# EAGLE design iit_hawkrod_main_board (EAGLE 9.6.2)
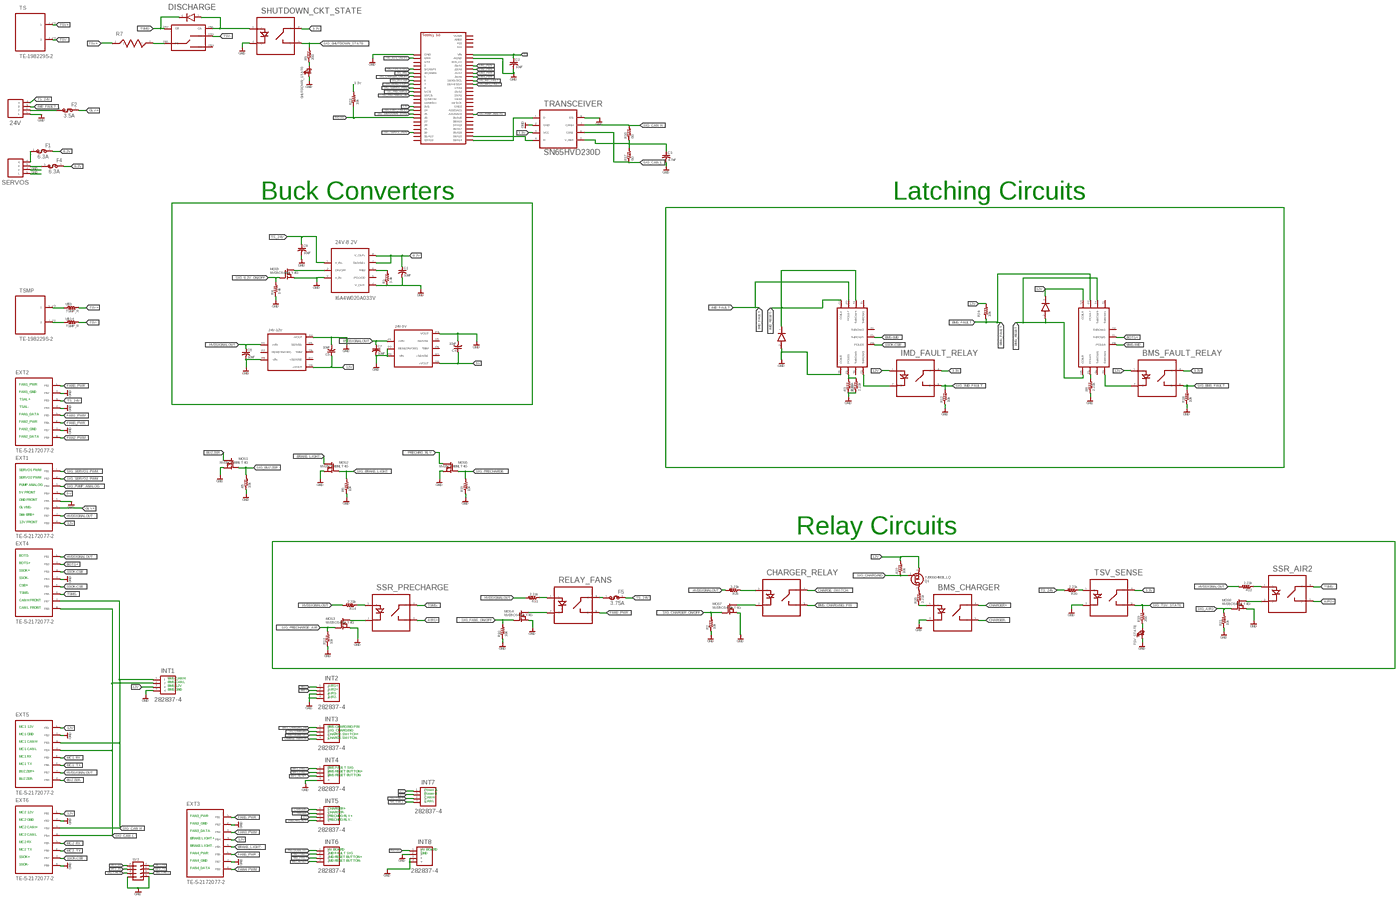
[diagram p0: schematic, sheet 1, overview]
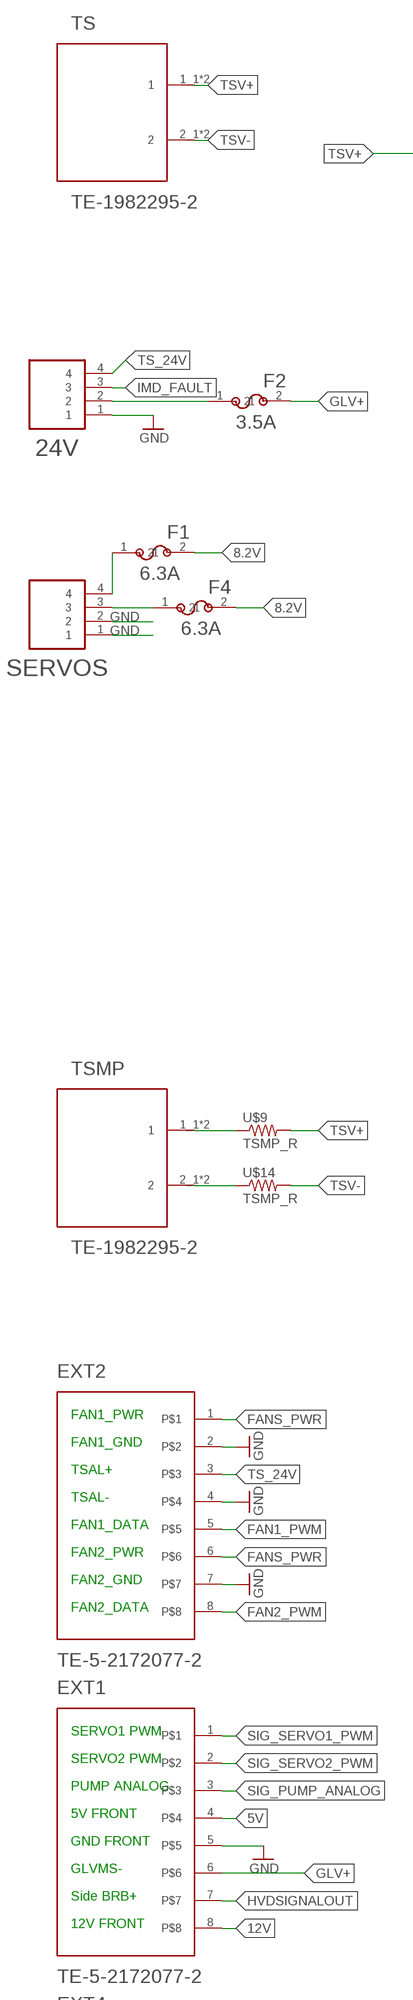
[diagram p1: schematic, sheet 1, part 1 of 5]
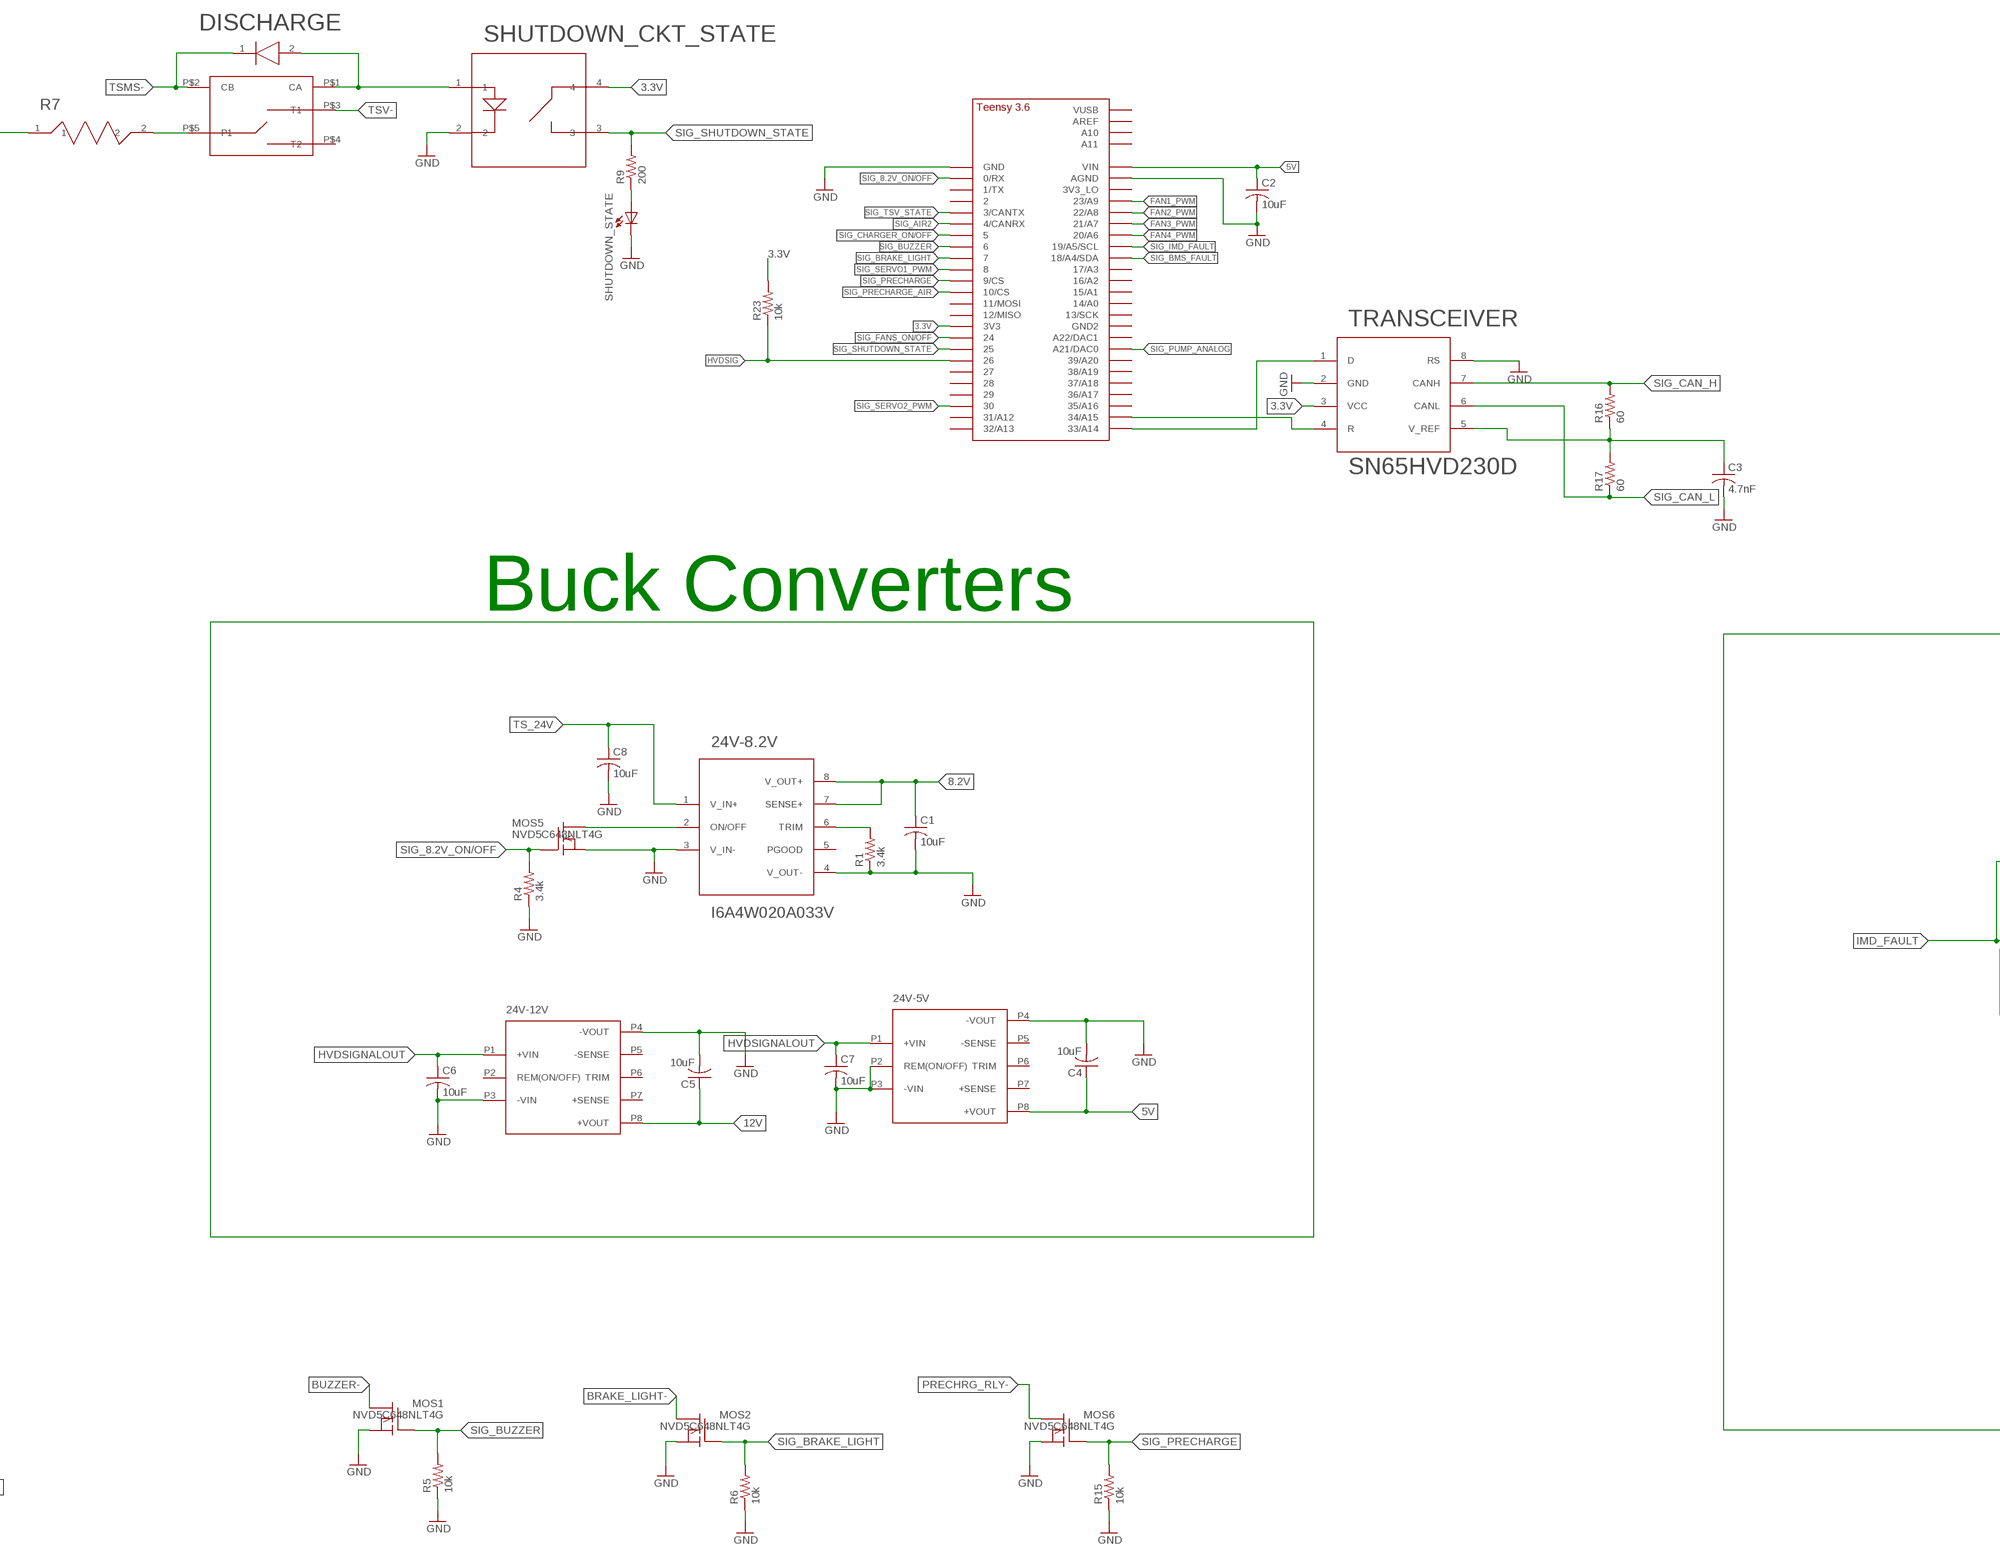
[diagram p2: schematic, sheet 1, part 2 of 5]
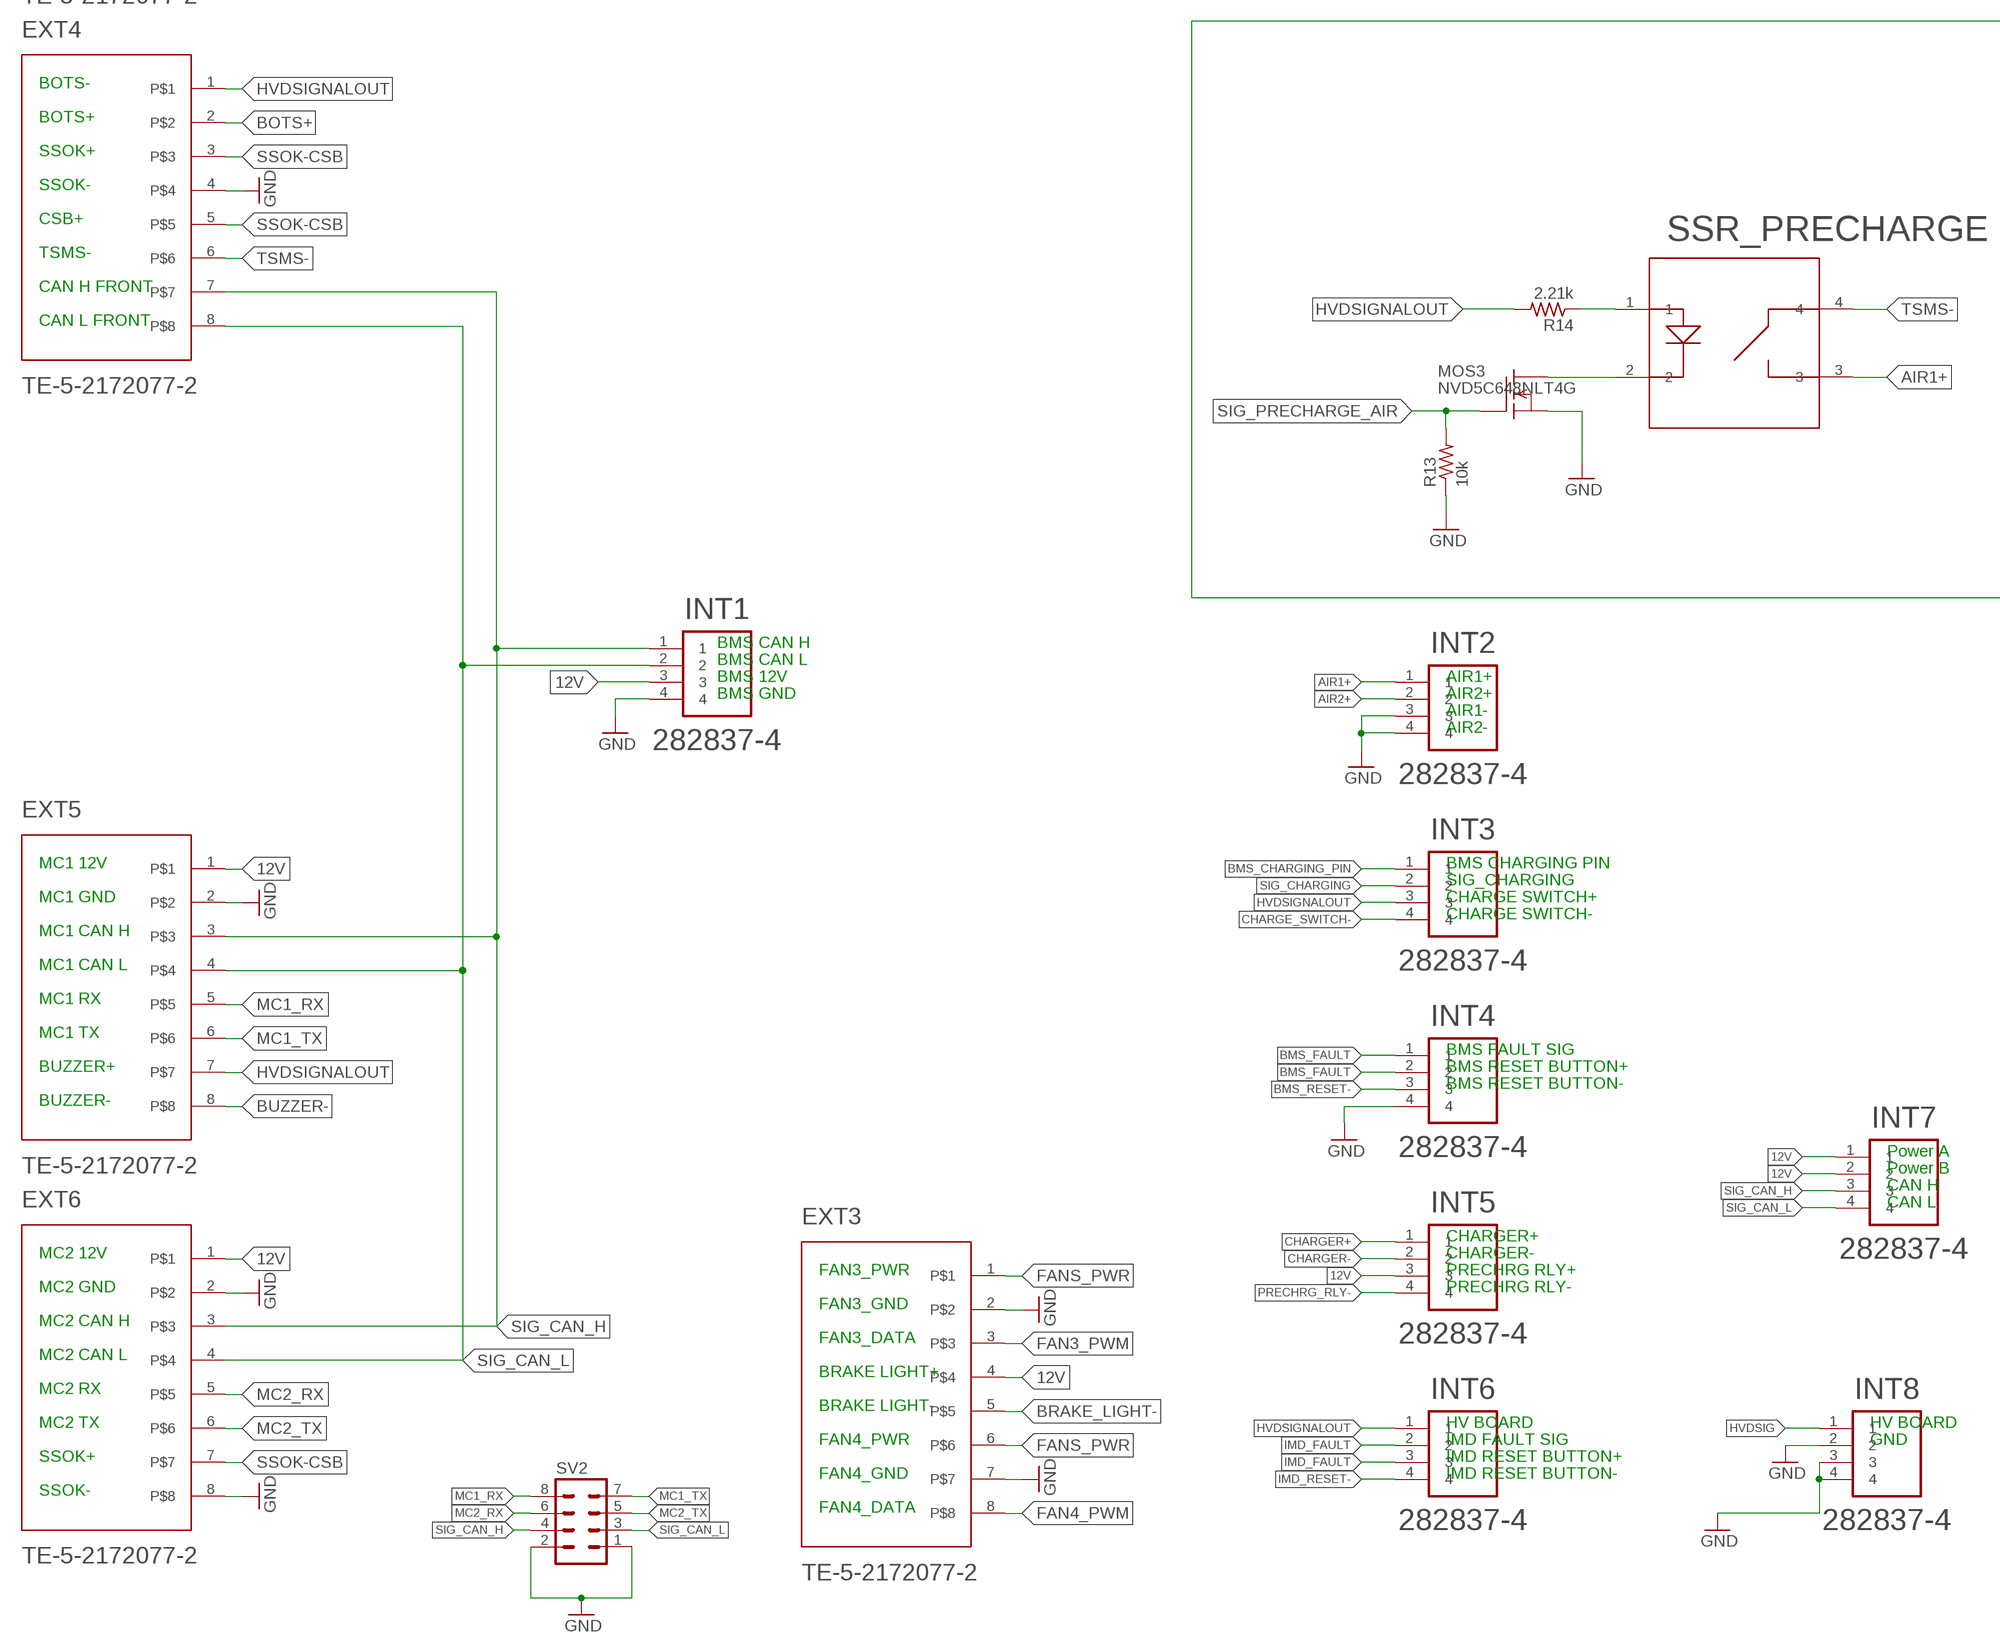
[diagram p3: schematic, sheet 1, part 3 of 5]
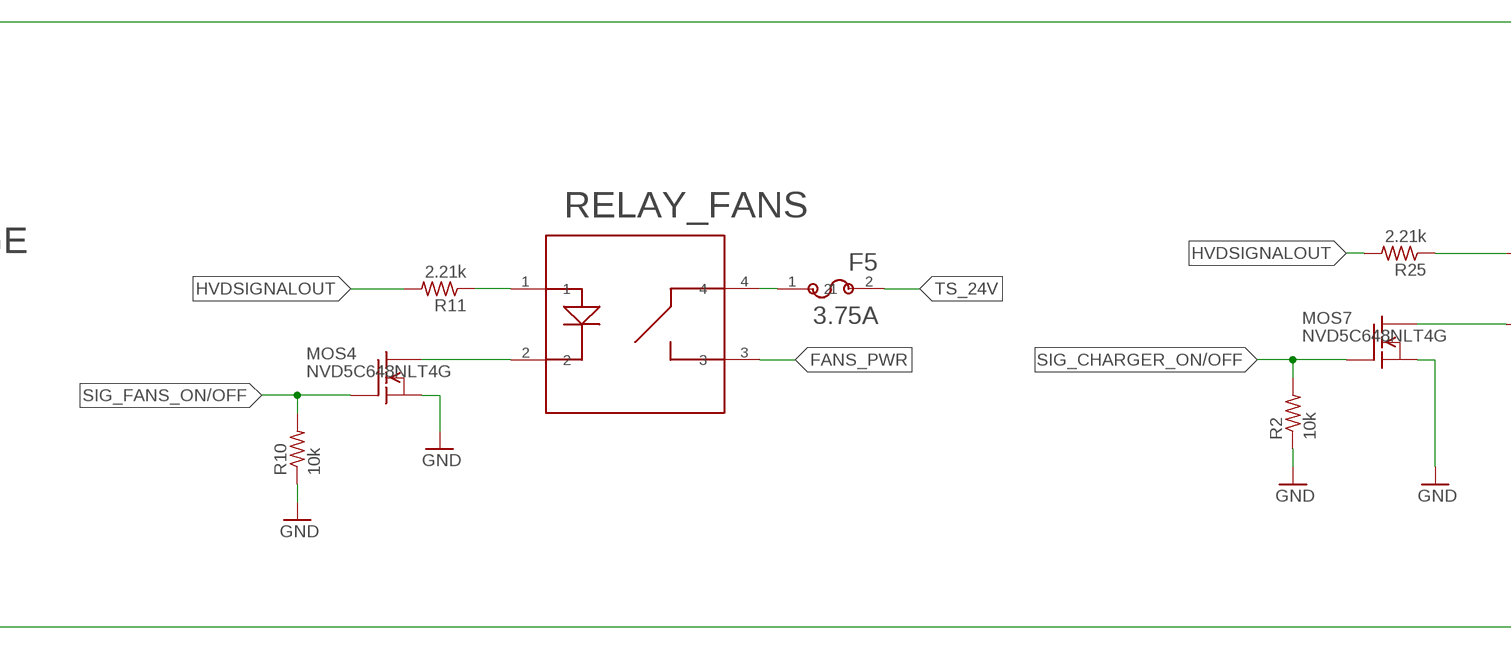
[diagram p4: schematic, sheet 1, part 4 of 5]
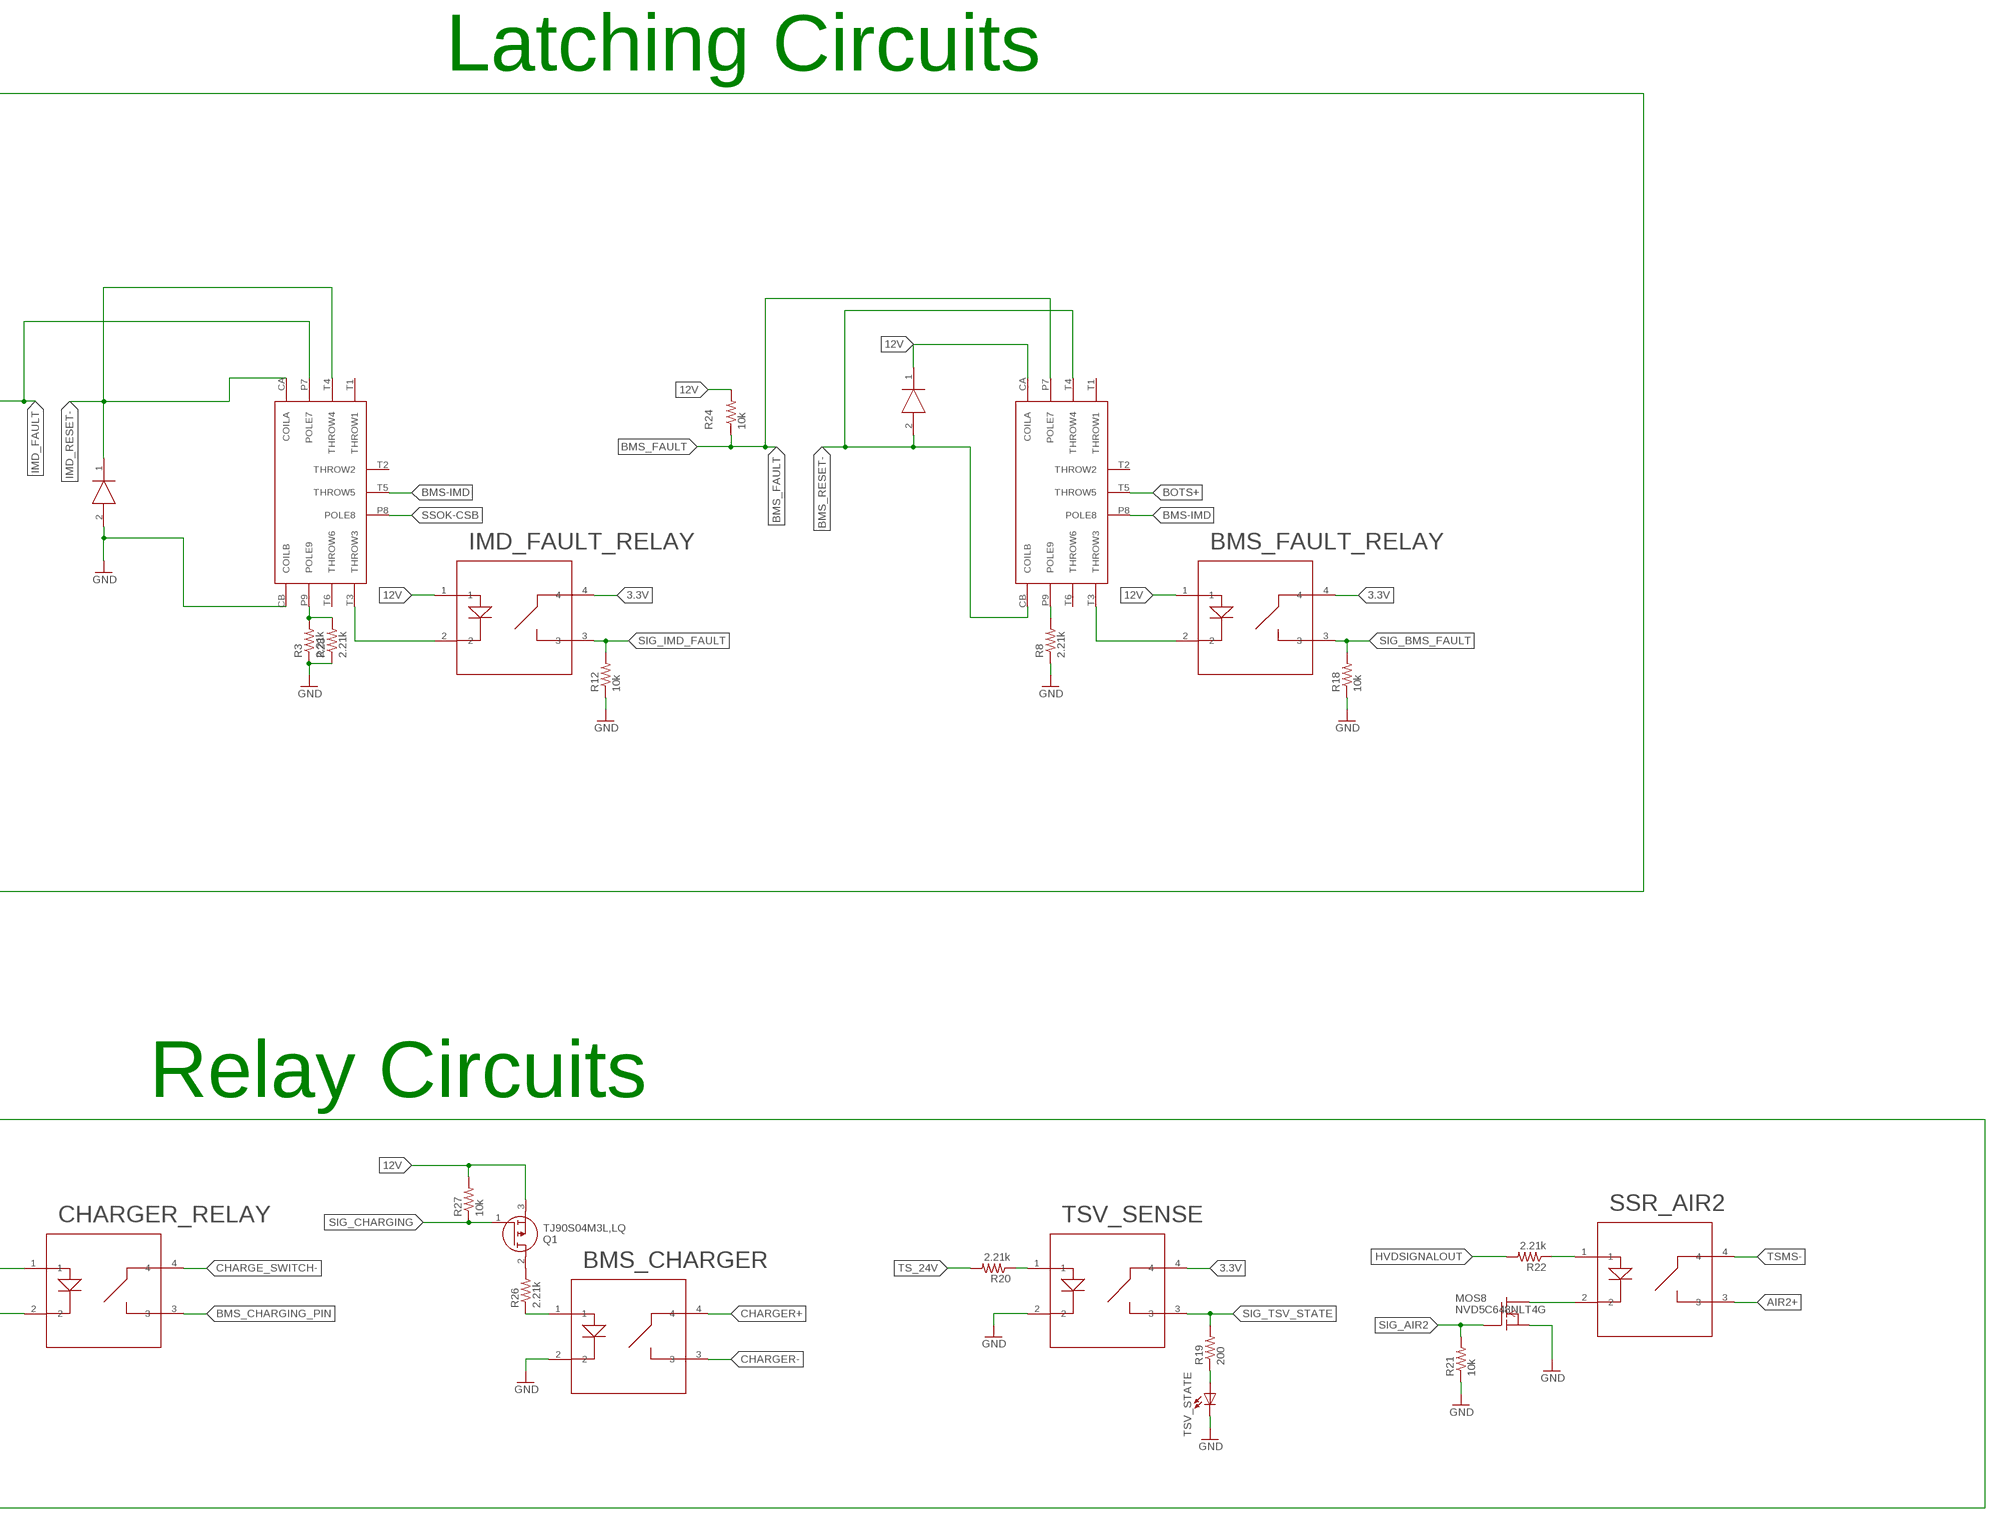
[diagram p5: schematic, sheet 1, part 5 of 5]

## Parts
24V  282837-4  [TE_282837-4]
24V-5V  IRS-5/10-Q12NF-C  [IRS-5/10-Q12NF-C]
24V-8.2V  I6A4W020A033V  [I6A4W020A033V]
24V-12V  IRS-5/10-Q12NF-C  [IRS-5/10-Q12NF-C]
BMS_CHARGER  G3VM-61GR2  [SOP4]
BMS_FAULT_RELAY  G3VM-61GR2  [SOP4]
C1  10uF  C-USC1206  [C1206]
C2  10uF  C-USC1206  [C1206]
C3  4.7nF  C-USC1206  [C1206]
C4  10uF  C-USC1206  [C1206]
C5  10uF  C-USC1206  [C1206]
C6  10uF  C-USC1206  [C1206]
C7  10uF  C-USC1206  [C1206]
C8  10uF  C-USC1206  [C1206]
CHARGER_RELAY  G3VM-61GR2  [SOP4]
EXT1  TE-5-2172077-2  [TE-5-2172077-2]
EXT2  TE-5-2172077-2  [TE-5-2172077-2]
EXT3  TE-5-2172077-2  [TE-5-2172077-2]
EXT4  TE-5-2172077-2  [TE-5-2172077-2]
EXT5  TE-5-2172077-2  [TE-5-2172077-2]
EXT6  TE-5-2172077-2  [TE-5-2172077-2]
F1  6.3A  SMD_FUSE_HOLDER  [SMD_FUSE_HOLDER]
F2  3.5A  SMD_FUSE_HOLDER  [SMD_FUSE_HOLDER]
F4  6.3A  SMD_FUSE_HOLDER  [SMD_FUSE_HOLDER]
F5  3.75A  SMD_FUSE_HOLDER  [SMD_FUSE_HOLDER]
IMD_FAULT_RELAY  G3VM-61GR2  [SOP4]
INT1  282837-4  [TE_282837-4]
INT2  282837-4  [TE_282837-4]
INT3  282837-4  [TE_282837-4]
INT4  282837-4  [TE_282837-4]
INT5  282837-4  [TE_282837-4]
INT6  282837-4  [TE_282837-4]
INT7  282837-4  [TE_282837-4]
INT8  282837-4  [TE_282837-4]
MOS1  NVD5C648NLT4G  [DPAK]
MOS2  NVD5C648NLT4G  [DPAK]
MOS3  NVD5C648NLT4G  [DPAK]
MOS4  NVD5C648NLT4G  [DPAK]
MOS5  NVD5C648NLT4G  [DPAK]
MOS6  NVD5C648NLT4G  [DPAK]
MOS7  NVD5C648NLT4G  [DPAK]
MOS8  NVD5C648NLT4G  [DPAK]
Q1  TJ90S04M3L,LQ  [TJ90S04M3LLQ]
R1  3.4k  R-US_R1206  [R1206]
R2  10k  R-US_R1206  [R1206]
R3  2.21k  R-US_R1206  [R1206]
R4  3.4k  R-US_R1206  [R1206]
R5  10k  R-US_M1206  [M1206]
R6  10k  R-US_M1206  [M1206]
R7  HSA501K0J  [HSA501K0J]
R8  2.21k  R-US_R1206  [R1206]
R9  200  R-US_M1206  [M1206]
R10  10k  R-US_R1206  [R1206]
R11  2.21k  R-US_R1206  [R1206]
R12  10k  R-US_M1206  [M1206]
R13  10k  R-US_M1206  [M1206]
R14  2.21k  R-US_R1206  [R1206]
R15  10k  R-US_M1206  [M1206]
R16  60  R-US_R1206  [R1206]
R17  60  R-US_R1206  [R1206]
R18  10k  R-US_M1206  [M1206]
R19  200  R-US_M1206  [M1206]
R20  2.21k  R-US_R1206  [R1206]
R21  10k  R-US_M1206  [M1206]
R22  2.21k  R-US_R1206  [R1206]
R23  10k  R-US_M1206  [M1206]
R24  10k  R-US_M1206  [M1206]
R25  2.21k  R-US_R1206  [R1206]
R26  2.21k  R-US_R1206  [R1206]
R27  10k  R-US_R1206  [R1206]
R28  2.21k  R-US_R1206  [R1206]
RELAY_FANS  G3VM-61GR2  [SOP4]
SERVOS  282837-4  [TE_282837-4]
SHUTDOWN_CKT_STATE  G3VM-61GR2  [SOP4]
SHUTDOWN_STATE  LEDCHIP-LED0805  [CHIP-LED0805]
SSR_AIR2  G3VM-61GR2  [SOP4]
SSR_PRECHARGE  G3VM-61GR2  [SOP4]
SV2  MA04-2  [MA04-2]
TEENSY_3.6  TEENSY_3.5/3.6_BASIC  [TEENSY_3.5/3.6_BASIC]
TRANSCEIVER  SN65HVD230D  [R-PDSO-8]
TS  TE-1982295-2  [TE-1982295-2]
TSMP  TE-1982295-2  [TE-1982295-2]
TSV_SENSE  G3VM-61GR2  [SOP4]
TSV_STATE  LEDCHIP-LED0805  [CHIP-LED0805]
U$1  G2RL-1-HA  [G2RL-1-HA]
U$3  CS1M-E3/H  [DO-214AC]
U$4  CS1M-E3/H  [DO-214AC]
U$5  CS1M-E3/H  [DO-214AC]
U$6  27E046_RELAY_MOUNT  [27E046_RELAY_MOUNT]
U$7  27E046_RELAY_MOUNT  [27E046_RELAY_MOUNT]
U$9  TSMP_R  [TSMP_R]
U$14  TSMP_R  [TSMP_R]

## Nets
3.3V [20mil]: BMS_FAULT_RELAY.4 IMD_FAULT_RELAY.4 R23.2 SHUTDOWN_CKT_STATE.4 TEENSY_3.6.3V3 TRANSCEIVER.3(VCC) TSV_SENSE.4
5V [20mil]: 24V-5V.P8(+VOUT) C2.1 C4.1 EXT1.4 TEENSY_3.6.VIN
8.2V [Servos]: 24V-8.2V.7(SENSE+) 24V-8.2V.8(V_OUT+) C1.1 F1.2 F4.2
12V [BMS 12V]: 24V-12V.P8(+VOUT) BMS_FAULT_RELAY.1 C5.1 EXT1.8 EXT3.4 EXT5.1 EXT6.1 IMD_FAULT_RELAY.1 INT1.3 INT5.3 INT7.1 INT7.2 Q1.3(S) R24.2 R27.2 U$5.1 U$7.CA(COILA)
AIR1+ [20mil]: INT2.1 SSR_PRECHARGE.3
AIR2+ [20mil]: INT2.2 SSR_AIR2.3
BMS-IMD [20mil]: U$6.T5(THROW5) U$7.P8(POLE8)
BMS_CHARGING_PIN [20mil]: CHARGER_RELAY.3 INT3.1
BMS_FAULT [20mil]: INT4.1 INT4.2 R24.1 U$7.P7(POLE7)
BMS_RESET- [20mil]: INT4.3 U$5.2 U$7.CB(COILB) U$7.T4(THROW4)
BOTS+ [20mil]: EXT4.2 U$7.T5(THROW5)
BRAKE_LIGHT- [20mil]: EXT3.5 MOS2.4(D)
BUZZER- [20mil]: EXT5.8 MOS1.4(D)
CHARGE_SWITCH- [20mil]: CHARGER_RELAY.4 INT3.4
CHARGER+ [20mil]: BMS_CHARGER.4 INT5.1
CHARGER- [20mil]: BMS_CHARGER.3 INT5.2
FAN1_PWM [10mil]: EXT2.5 TEENSY_3.6.23/A9
FAN2_PWM [10mil]: EXT2.8 TEENSY_3.6.22/A8
FAN3_PWM [10mil]: EXT3.3 TEENSY_3.6.21/A7
FAN4_PWM [10mil]: EXT3.8 TEENSY_3.6.20/A6
FANS_PWR [20mil]: EXT2.1 EXT2.6 EXT3.1 EXT3.6 RELAY_FANS.3
GLV+ [2.33A-GLV]: EXT1.6 F2.2
GND [20mil]: 24V-5V.P2(REM(ON/OFF)) 24V-5V.P3(-VIN) 24V-5V.P4(-VOUT) 24V-8.2V.3(V_IN-) 24V-8.2V.4(V_OUT-) 24V-12V.P3(-VIN) 24V-12V.P4(-VOUT) 24V.1 BMS_CHARGER.2 C1.2 C2.2 C3.2 C4.2 C5.2 C6.2 C7.2 C8.2 EXT1.5 EXT2.2 EXT2.4 EXT2.7 EXT3.2 EXT3.7 EXT4.4 EXT5.2 EXT6.2 EXT6.8 INT1.4 INT2.3 INT2.4 INT4.4 INT8.2 INT8.3 INT8.4 MOS1.3(S) MOS2.3(S) MOS3.3(S) MOS4.3(S) MOS5.3(S) MOS6.3(S) MOS7.3(S) MOS8.3(S) R1.1 R2.1 R3.1 R4.1 R5.1 R6.1 R8.1 R10.1 R12.1 R13.1 R15.1 R18.1 R21.1 R28.1 SERVOS.1 SERVOS.2 SHUTDOWN_CKT_STATE.2 SHUTDOWN_STATE.C SV2.1 SV2.2 TEENSY_3.6.AGND TEENSY_3.6.GND TRANSCEIVER.2(GND) TRANSCEIVER.8(RS) TSV_SENSE.2 TSV_STATE.C U$4.2 U$6.CB(COILB)
HVDSIG [20mil]: INT8.1 R23.1 TEENSY_3.6.26
HVDSIGNALOUT [20mil]: 24V-5V.P1(+VIN) 24V-12V.P1(+VIN) C6.1 C7.1 EXT1.7 EXT4.1 EXT5.7 INT3.3 INT6.1 R11.2 R14.2 R22.2 R25.2
IMD_FAULT [20mil]: 24V.3 INT6.2 INT6.3 U$6.P7(POLE7)
IMD_RESET- [20mil]: INT6.4 U$4.1 U$6.CA(COILA) U$6.T4(THROW4)
MC1_RX [20mil]: EXT5.5 SV2.8
MC1_TX [20mil]: EXT5.6 SV2.7
MC2_RX [20mil]: EXT6.5 SV2.6
MC2_TX [20mil]: EXT6.6 SV2.5
N$1 [20mil]: 24V-8.2V.6(TRIM) R1.2
N$2 [20mil]: 24V-8.2V.2(ON/OFF) MOS5.4(D)
N$3: 24V.2 F2.1
N$4 [20mil]: MOS4.4(D) RELAY_FANS.2
N$5 [20mil]: TSMP.1_1 TSMP.1_2 U$9.T1
N$6 [20mil]: TSMP.2_1 TSMP.2_2 U$14.T1
N$7 [HV]: R7.2 U$1.P$5(P1)
N$8 [20mil]: R11.1 RELAY_FANS.1
N$9 [20mil]: SHUTDOWN_CKT_STATE.1 U$1.P$1(CA) U$3.2
N$10 [20mil]: CHARGER_RELAY.2 MOS7.4(D)
N$11: R3.2 R28.2 U$6.P9(POLE9)
N$12: F1.1 SERVOS.4
N$13: F4.1 SERVOS.3
N$14 [20mil]: F5.1 RELAY_FANS.4
N$15 [20mil]: R14.1 SSR_PRECHARGE.1
N$16: R8.2 U$7.P9(POLE9)
N$17 [20mil]: MOS3.4(D) SSR_PRECHARGE.2
N$18 [20mil]: R9.1 SHUTDOWN_STATE.A
N$19 [20mil]: R19.1 TSV_STATE.A
N$20 [20mil]: TEENSY_3.6.34/A15 TRANSCEIVER.4(R)
N$21 [20mil]: IMD_FAULT_RELAY.2 U$6.T3(THROW3)
N$22 [20mil]: R20.1 TSV_SENSE.1
N$23 [20mil]: BMS_FAULT_RELAY.2 U$7.T3(THROW3)
N$24 [20mil]: R22.1 SSR_AIR2.1
N$25 [20mil]: TEENSY_3.6.33/A14 TRANSCEIVER.1(D)
N$26 [20mil]: C3.1 R16.1 R17.2 TRANSCEIVER.5(V_REF)
N$27 [20mil]: MOS8.4(D) SSR_AIR2.2
N$30: Q1.2(D) R26.2
N$31: CHARGER_RELAY.1 R25.1
N$32: BMS_CHARGER.1 R26.1
PRECHRG_RLY- [20mil]: INT5.4 MOS6.4(D)
SIG_8.2V_ON/OFF [10mil]: MOS5.1(G) R4.2 TEENSY_3.6.0/RX
SIG_AIR2 [10mil]: MOS8.1(G) R21.2 TEENSY_3.6.4/CANRX
SIG_BMS_FAULT [10mil]: BMS_FAULT_RELAY.3 R18.2 TEENSY_3.6.18/A4/SDA
SIG_BRAKE_LIGHT [10mil]: MOS2.1(G) R6.2 TEENSY_3.6.7
SIG_BUZZER [10mil]: MOS1.1(G) R5.2 TEENSY_3.6.6
SIG_CAN_H [20mil]: EXT4.7 EXT5.3 EXT6.3 INT1.1 INT7.3 R16.2 SV2.4 TRANSCEIVER.7(CANH)
SIG_CAN_L [20mil]: EXT4.8 EXT5.4 EXT6.4 INT1.2 INT7.4 R17.1 SV2.3 TRANSCEIVER.6(CANL)
SIG_CHARGER_ON/OFF [10mil]: MOS7.1(G) R2.2 TEENSY_3.6.5
SIG_CHARGING [20mil]: INT3.2 Q1.1(G) R27.1
SIG_FANS_ON/OFF [10mil]: MOS4.1(G) R10.2 TEENSY_3.6.24
SIG_IMD_FAULT [10mil]: IMD_FAULT_RELAY.3 R12.2 TEENSY_3.6.19/A5/SCL
SIG_PRECHARGE [10mil]: MOS6.1(G) R15.2 TEENSY_3.6.9/CS
SIG_PRECHARGE_AIR [10mil]: MOS3.1(G) R13.2 TEENSY_3.6.10/CS
SIG_PUMP_ANALOG [20mil]: EXT1.3 TEENSY_3.6.21/DAC0(A21/DAC0)
SIG_SERVO1_PWM [10mil]: EXT1.1 TEENSY_3.6.8
SIG_SERVO2_PWM [10mil]: EXT1.2 TEENSY_3.6.30
SIG_SHUTDOWN_STATE [10mil]: R9.2 SHUTDOWN_CKT_STATE.3 TEENSY_3.6.25
SIG_TSV_STATE [10mil]: R19.2 TEENSY_3.6.3/CANTX TSV_SENSE.3
SSOK-CSB [20mil]: EXT4.3 EXT4.5 EXT6.7 U$6.P8(POLE8)
TS_24V [20mil]: 24V-8.2V.1(V_IN+) 24V.4 C8.1 EXT2.3 F5.2 R20.2
TSMS- [20mil]: EXT4.6 SSR_AIR2.4 SSR_PRECHARGE.4 U$1.P$2(CB) U$3.1
TSV+ [HV]: R7.1 TS.1_1 TS.1_2 U$9.T2
TSV- [HV]: TS.2_1 TS.2_2 U$1.P$3(T1) U$14.T2
Unconnected: 24V-5V.P5(-SENSE) 24V-5V.P6(TRIM) 24V-5V.P7(+SENSE) 24V-8.2V.5(PGOOD) 24V-12V.P2(REM(ON/OFF)) 24V-12V.P5(-SENSE) 24V-12V.P6(TRIM) 24V-12V.P7(+SENSE) TEENSY_3.6.1/TX TEENSY_3.6.2 TEENSY_3.6.3V3_LO TEENSY_3.6.11/MOSI TEENSY_3.6.12/MISO TEENSY_3.6.13/SCK TEENSY_3.6.14/A0 TEENSY_3.6.15/A1 TEENSY_3.6.16/A2 TEENSY_3.6.17/A3 TEENSY_3.6.27 TEENSY_3.6.28 TEENSY_3.6.29 TEENSY_3.6.31/A12 TEENSY_3.6.32/A13 TEENSY_3.6.35/A16 TEENSY_3.6.36/A17 TEENSY_3.6.37/A18 TEENSY_3.6.38/A19 TEENSY_3.6.39/A20 TEENSY_3.6.A10 TEENSY_3.6.A11 TEENSY_3.6.A22/DAC1 TEENSY_3.6.AREF TEENSY_3.6.GND2 TEENSY_3.6.VUSB U$1.P$4(T2) U$6.T1(THROW1) U$6.T2(THROW2) U$6.T6(THROW6) U$7.T1(THROW1) U$7.T2(THROW2) U$7.T6(THROW6)

## Notes on the sheet
- DISCHARGE
- Buck Converters | Latching Circuits
- FAN1_PWR
- FAN1_GND
- TSAL+
- TSAL-
- FAN1_DATA
- FAN2_PWR
- FAN2_GND
- FAN2_DATA
- SERVO1 PWM
- SERVO2 PWM
- PUMP ANALOG
- 5V FRONT
- GND FRONT
- GLVMS-
- Side BRB+
- 12V FRONT
- Relay Circuits
- BOTS-
- BOTS+
- SSOK+
- SSOK-
- CSB+
- TSMS-
- CAN H FRONT
- CAN L FRONT
- BMS CAN H
- BMS CAN L
- BMS 12V | AIR1+
- BMS GND | AIR2+
- AIR1-
- AIR2-
- MC1 12V | BMS CHARGING PIN
- SIG_CHARGING
- MC1 GND | CHARGE SWITCH+
- CHARGE SWITCH-
- MC1 CAN H
- MC1 CAN L
- MC1 RX
- MC1 TX
- BMS FAULT SIG
- BUZZER+ | BMS RESET BUTTON+
- BMS RESET BUTTON-
- BUZZER-
- Power A
- Power B
- CAN H
- CAN L
- CHARGER+
- MC2 12V | CHARGER-
- FAN3_PWR | PRECHRG RLY+
- MC2 GND | PRECHRG RLY-
- FAN3_GND
- MC2 CAN H
- FAN3_DATA
- MC2 CAN L
- BRAKE LIGHT+
- MC2 RX
- BRAKE LIGHT-
- MC2 TX | HV BOARD | HV BOARD
- FAN4_PWR | IMD FAULT SIG | GND
- SSOK+ | IMD RESET BUTTON+
- FAN4_GND | IMD RESET BUTTON-
- SSOK-
- FAN4_DATA

## Library data of the parts
24V INT1-INT8 SERVOS = 282837-4:282837-4: TERM BLOCK 5.08MM 4POS SIDE ENTY; MANUFACTURER: TE CONNECTIVITY; PARTREV: G3; STANDARD: MANUFACTURER RECOMMENDATIONS
24V-5V 24V-12V = SAE2020March:IRS-5/10-Q12NF-C
24V-8.2V = SAE_2019:I6A4W020A033V: I6A4W020A033V TDK-Lamda - 250W, 9-53V Input Non-isolated DC-DC Converter
BMS_CHARGER BMS_FAULT_RELAY CHARGER_RELAY IMD_FAULT_RELAY RELAY_FANS SHUTDOWN_CKT_STATE SSR_AIR2 SSR_PRECHARGE = SAE_2019:G3VM-61GR2: G3VM-61GR2 MOS FET Relays with 1.7-A switching Designed for Switching Minute Signals and Analog Signals.
C1-C8 = rcl:C-US: CAPACITOR, American symbol; SPICEPREFIX: C
EXT1-EXT6 = SAE_2019:TE-5-2172077-2: 5-2172077-2 TE - Circular Metric Connectors M12 FMLE PNLREAR 8P ACODE PCBSTD RA SHLD
F1 F2 F4 F5 = SAE_2019:SMD_FUSE_HOLDER: SMD Fuse holder LittelFuse - 154/154T/154L/154TL Series OMNI-BLOK® Fuse and Holder Assembly
MOS1-MOS8 = SAE_2019:NVD5C648NLT4G: NVD5C648NLT4G ON Semi - Power MOSFET 60 V, 4.1 m, 89 A, Single N−Channel
Q1 = SamacSys_Parts:TJ90S04M3L,LQ: Pb-F POWER MOSFET TRANSISTOR DPAK+ PD=180W F=1MHZ Source: Datasheet <https://toshiba.semicon-storage.com/>; DESCRIPTION: Pb-F POWER MOSFET TRANSISTOR DPAK+ PD=180W F=1MHZ; HEIGHT: 2.5mm; MANUFACTURER_NAME: Toshiba; MANUFACTURER_PART_NUMBER: TJ90S04M3L,LQ; MOUSER_PART_NUMBER: 757-TJ90S04M3LLQ; MOUSER_PRICE-STOCK: https://www.mouser.co.uk/ProductDetail/Toshiba/TJ90S04M3LLQ?qs=B6kkDfuK7%2FC7yO2QpUu1wg%3D%3D
R1-R6 R8-R28 = rcl:R-US_: RESISTOR, American symbol; SPICEPREFIX: R
R7 = SAE_2019:HSA501K0J: HSA501K0J TE - Wirewound Resistors - Chassis Mount HSA50 1K0 5%
SHUTDOWN_STATE TSV_STATE = adafruit:LED: LED OSRAM: - CHIPLED LG R971, LG N971, LY N971, LG Q971, LY Q971, LO R971, LY R971 LH N974, LH R974 LS Q976, LO Q976, LY Q976 LO Q996 - Hyper CHIPLED LW Q18S LB Q993, LB Q99A, LB R99A - SideLED LS A670, LO A670, LY A670, LG A670, LP A670 LB A673, LV A673, LT A673, LW A673 LH A674 LY A675 LS A676, LA A676, LO A676, LY A676, LW A676 LS A679, LY A679, LG A679 - Hyper Micro SIDELED® LS Y876, LA Y876, LO Y876, LY Y876 LT Y87S - SmartLED LW L88C, LW L88S LB L89C, LB L89S, LG L890 LS L89K, LO L89K, LY L89K LS L896, LA L896, LO L896, LY L896 - TOPLED LS T670, LO T670, LY T670, LG T670, LP T670 LSG T670, LSP T670, LSY T670, LOP T670, LYG T670 LG T671, LOG T671, LSG T671 LB T673, LV T673, LT T673, LW T673 LH T674 LS T676, LA T676, LO T676, LY T676, LB T676, LH T676, LSB T676, LW T676 LB T67C, LV T67C, LT T67C, LS T67K, LO T67K, LY T67K, LW E67C LS E67B, LA E67B, LO E67B, LY E67B, LB E67C, LV E67C, LT E67C LW T67C LS T679, LY T679, LG T679 LS T770, LO T770, LY T770, LG T770, LP T770 LB T773, LV T773, LT T773, LW T773 LH T774 LS E675, LA E675, LY E675, LS T675 LS T776, LA T776, LO T776, LY T776, LB T776 LHGB T686 LT T68C, LB T68C - Hyper Mini TOPLED® LB M676 - Mini TOPLED Santana® LG M470 LS M47K, LO M47K, LY M47K Source: http://www.osram.convergy.de/
SV2 = con-lstb:MA04-2: PIN HEADER; OC_FARNELL: unknown; OC_NEWARK: unknown
TEENSY_3.6 = SAE_2019:TEENSY_3.5/3.6_BASIC: Teensy 3.6
TRANSCEIVER = SAE_2019:SN65HVD230D: SN65HVD230 TI - 3.3-V CAN Bus Transceivers
TS TSMP = SAE_2019:TE-1982295-2: TE 1982295-2 Power to the Board 2P PIN POWER BUS BAR R/A RAPID LOCK BLK
TSV_SENSE = SAE_2020(2019Updated):G3VM-61GR2: G3VM-61GR2 MOS FET Relays with 1.7-A switching Designed for Switching Minute Signals and Analog Signals.
U$1 = SAE_2020(2019Updated):G2RL-1-HA
U$3-U$5 = SAE_2019:CS1M-E3/H: CS1M-E3/H Vishay - Surface-Mount Glass Passivated Rectifier
U$6 U$7 = SAE2020March:27E046_RELAY_MOUNT: Latch relay for IMD and BMS latching circuit per SAE 2020 rules. 27E046 socket that is used to mount the KUMP-14D18-24 relay. 3PDT relay.
U$9 U$14 = AVA_SAE2020:TSMP_R

## Net classes
1 2.33A-GLV: width 1.27 mm, drill 0.254 mm, clearance 0.254 mm
2 HV: width 0.508 mm, drill 0.305 mm, clearance 0.305 mm
3 MC-1.7A: width 1.626 mm
4 Servos: width 1.524 mm
5 Pump 2.55A: width 3.048 mm
6 20mil: width 0.508 mm
7 10mil: width 0.254 mm
8 BMS 12V: width 0.508 mm

## Board
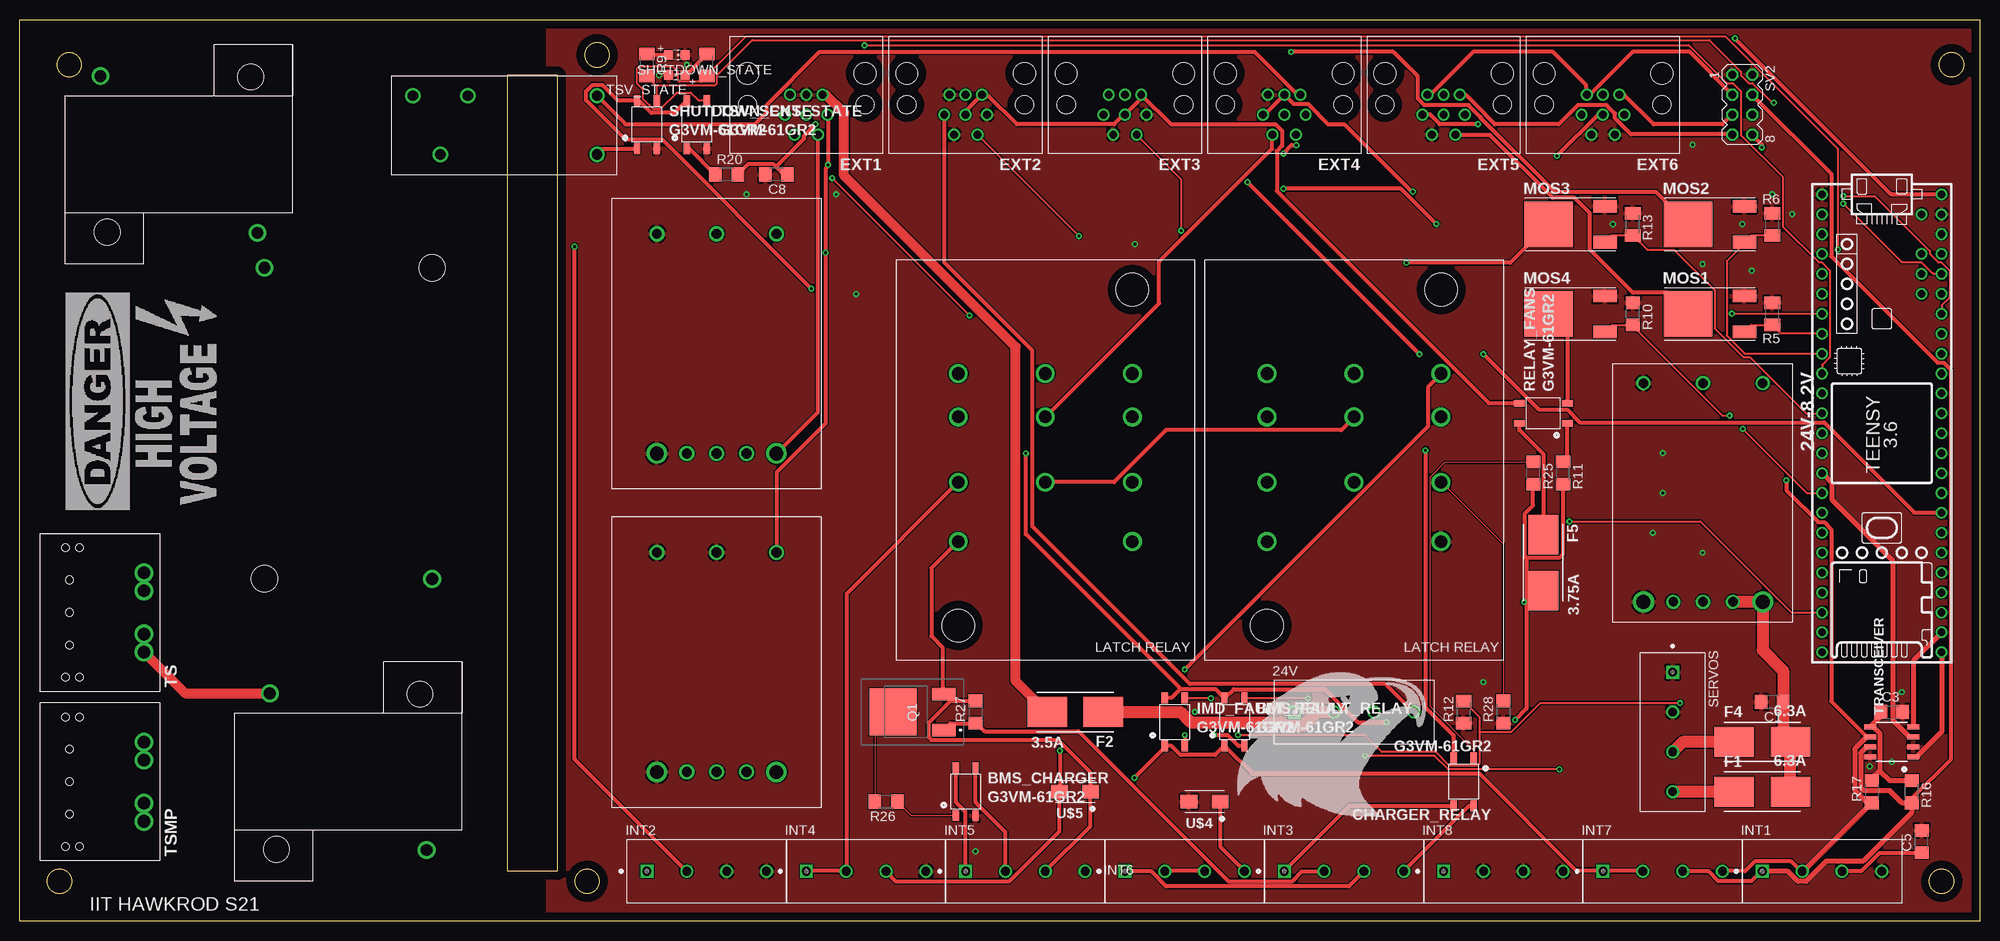
[diagram p6: board, top side]
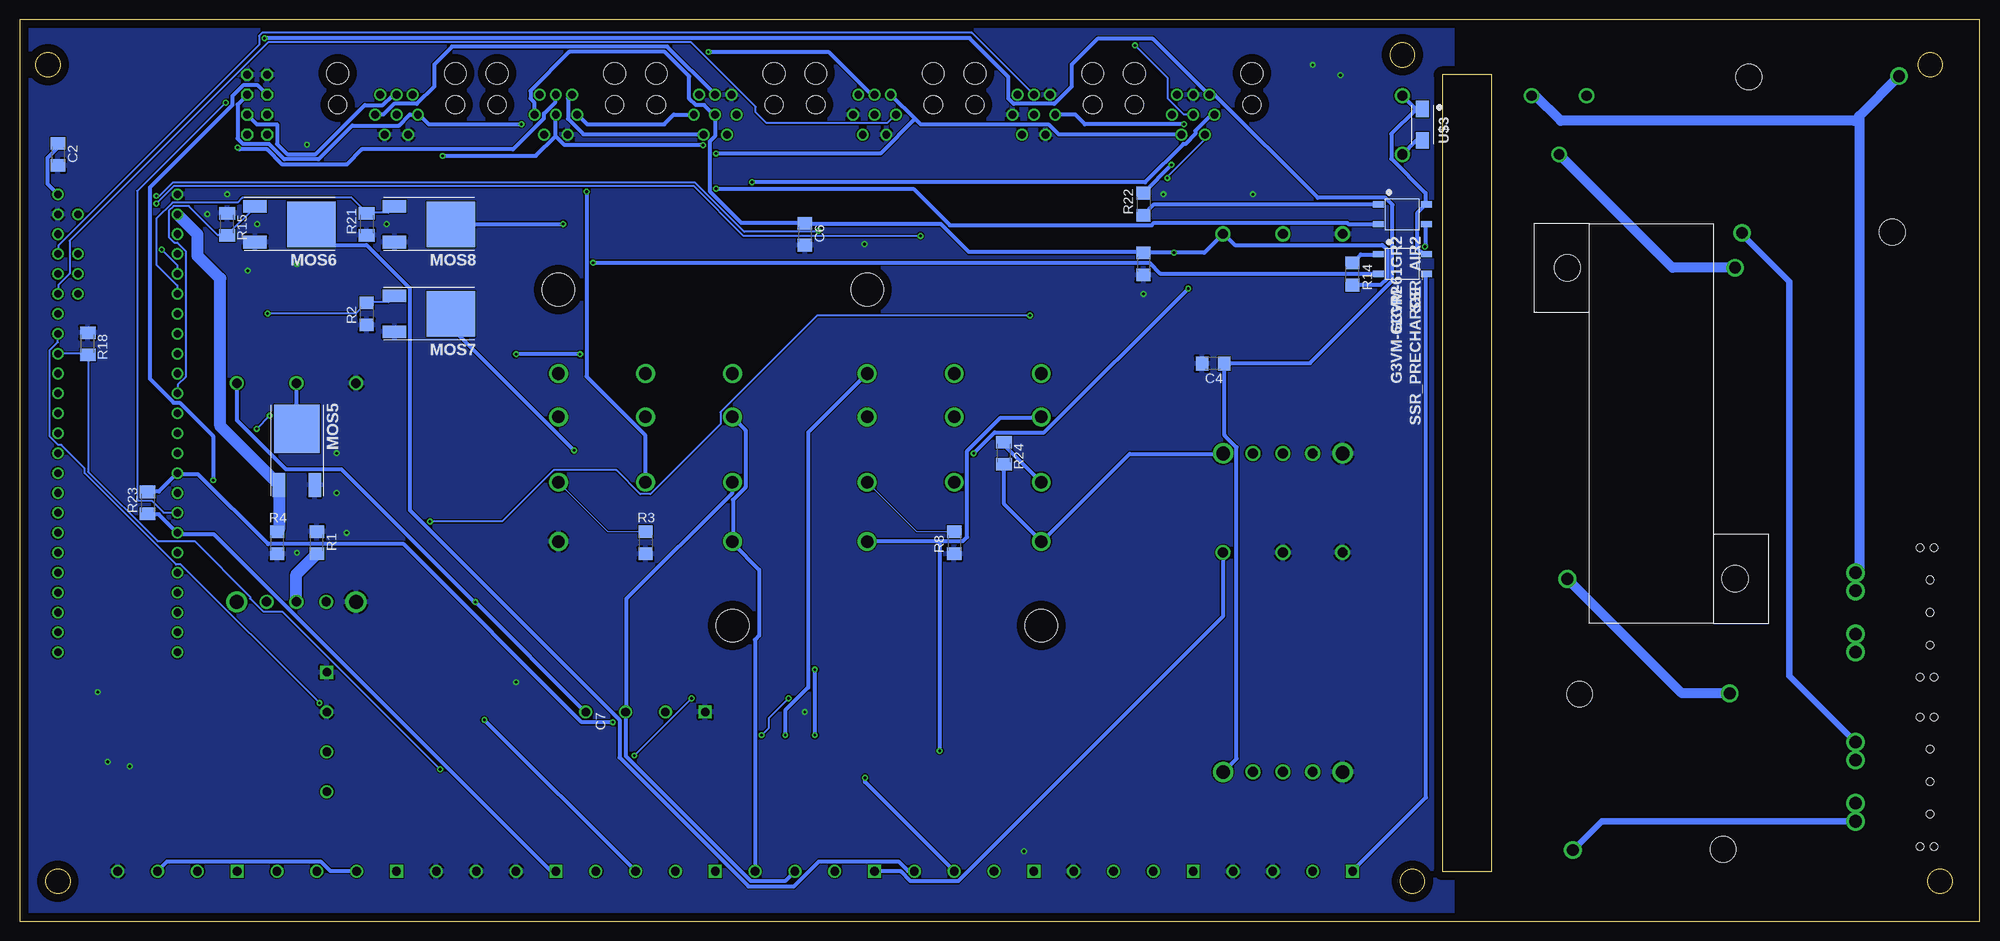
[diagram p7: board, bottom side, seen from below]

Size 250 x 115 mm. Coordinates in mm from the lower left corner, seen from the top.
Outline: 0,0 0,115 250,115 250,0 0,0
Outline: 68.58,107.95 68.58,6.35 62.23,6.35 62.23,107.95 68.58,107.95
Outline: circle at 5.08,5.08 radius 1.52
Outline: circle at 245.11,5.08 radius 1.52
Outline: circle at 246.38,109.22 radius 1.52
Outline: circle at 6.35,109.22 radius 1.52
Outline: circle at 73.66,110.49 radius 1.52
Outline: circle at 72.39,5.08 radius 1.52
Copper layers (1*16): Top 0.035mm / dielectric 1.5mm / Bottom 0.035mm
Design rules "default": minimum track width 6mil, minimum drill 0.35mm, track to track 6mil, track to pad 6mil, pad to pad 6mil, via to via 6mil, smd to smd 6mil, copper to edge 40mil, drill to drill 6mil, minimum pad ring 10mil, minimum via ring 8mil, stop-mask expansion 4mil, vias tented up to drill 0mil, thermal gap 10mil

### Footprints (pad centres in the part's own frame; a part is rotated, then mirrored left to right if it is on the bottom)
TE_282837-4 = drill 1.1 square: 1 0,0 | drill 1.1: 2 5.08,0; 3 10.16,0; 4 15.24,0
IRS-5/10-Q12NF-C = drill 1.25 pad 1.93: P1 -14,0; P2 -14,-7.62; P3 -14,-15.24; P5 14,-11.43; P6 14,-7.62; P7 14,-3.81 | drill 1.75 pad 2.184: P4 14,-15.24; P8 14,0
I6A4W020A033V = drill 1.2: 1 2.5,19.1; 2 2.5,11.5; 3 2.5,3.9; 5 30.4,7.7; 6 30.4,11.5; 7 30.4,15.3 | drill 1.8: 4 30.4,3.9; 8 30.4,19.1
SOP4 = smd 0.8 x 1.4: 1 -1.27,-3.05; 2 1.27,-3.05; 3 1.27,3.05; 4 -1.27,3.05
C1206 = smd 1.6 x 1.8: 1 -1.4,0; 2 1.4,0
TE-5-2172077-2 = drill 1: 1 0,0; 2 1.5,2.54; 3 2.725,0; 4 2.075,-2.54; 5 0,-2.54; 6 -2.075,-2.54; 7 -2.725,0; 8 -1.5,2.54 | hole 2.35: -7.5,-1.27; 7.5,-1.27 | hole 2.8: -7.5,-5.27; 7.5,-5.27
SMD_FUSE_HOLDER = smd 5.04 x 3.81: 1 -3.59,0; 2 3.59,0
DPAK = smd 3 x 1.6: 1 2.79,-2.285; 3 2.79,2.285 | smd 6.2 x 5.8: 4 -4.39,0
TJ90S04M3LLQ = smd 1.6 x 3: 1 -2.3,-4.85; 3 2.3,-4.85 | smd 6 x 6: 2 0,1.65
R1206 = smd 1.6 x 1.803: 1 -1.422,0; 2 1.422,0
M1206 = smd 1.6 x 2: 1 -1.4,0; 2 1.4,0
HSA501K0J = drill 1.5: 1 -19.85,10.7; 2 19.85,-10.7 | hole 3.4: 19.85,10.7; -19.85,-10.7
CHIP-LED0805 = smd 1.2 x 1.2: A 0,-1.05; C 0,1.05
MA04-2 = drill 1.016 octagon: 1 -3.81,-1.27; 2 -3.81,1.27; 3 -1.27,-1.27; 4 -1.27,1.27; 5 1.27,-1.27; 6 1.27,1.27; 7 3.81,-1.27; 8 3.81,1.27
TEENSY_3.5/3.6_BASIC = drill 0.965: 0/RX -25.4,-7.62; 1/TX -22.86,-7.62; 2 -20.32,-7.62; 3/CANTX -17.78,-7.62; 3V3 7.62,-7.62; 3V3_LO -22.86,7.62; 4/CANRX -15.24,-7.62; 5 -12.7,-7.62; 6 -10.16,-7.62; 7 -7.62,-7.62; 8 -5.08,-7.62; 9/CS -2.54,-7.62; 10/CS 0,-7.62; 11/MOSI 2.54,-7.62; 12/MISO 5.08,-7.62; 13/SCK 5.08,7.62; 14/A0 2.54,7.62; 15/A1 0,7.62; 16/A2 -2.54,7.62; 17/A3 -5.08,7.62; 18/A4/SDA -7.62,7.62; 19/A5/SCL -10.16,7.62; 20/A6 -12.7,7.62; 21/A7 -15.24,7.62; 21/DAC0 12.7,7.62; 22/A8 -17.78,7.62; 23/A9 -20.32,7.62; 24 10.16,-7.62; 25 12.7,-7.62; 26 15.24,-7.62; 27 17.78,-7.62; 28 20.32,-7.62; 29 22.86,-7.62; 30 25.4,-7.62; 31/A12 27.94,-7.62; 32/A13 30.48,-7.62; 33/A14 30.48,7.62; 34/A15 27.94,7.62; 35/A16 25.4,7.62; 36/A17 22.86,7.62; 37/A18 20.32,7.62; 38/A19 17.78,7.62; 39/A20 15.24,7.62; A10 -17.78,5.08; A11 -15.24,5.08; A22/DAC1 10.16,7.62; AGND -25.4,7.62; AREF -20.32,5.08; GND -27.94,-7.62; GND2 7.62,7.62; VIN -27.94,7.62; VUSB -25.4,5.08
R-PDSO-8 = smd 0.6 x 1.5: 1 -1.905,-2.75; 2 -0.635,-2.75; 3 0.635,-2.75; 4 1.905,-2.75; 5 1.905,2.75; 6 0.635,2.75; 7 -0.635,2.75; 8 -1.905,2.75
TE-1982295-2 = drill 1.6: 1_1 -5.05,-9.5; 1_2 -2.75,-9.5; 2_1 2.75,-9.5; 2_2 5.05,-9.5 | hole 1: 8.25,0.5; 8.25,-1.3; -8.25,0.5; -8.25,-1.3; 0,0; -4.15,0; 4.15,0
G2RL-1-HA = drill 1.3: P$1 0,0; P$2 0,7.5; P$3 -16.5,7.5; P$4 -23.5,7.5; P$5 -20,0
DO-214AC = smd 2.12 x 1.68: 1 -2,0; 2 2,0
27E046_RELAY_MOUNT = drill 1.6 pad 2.184: CA -11.1,-21.44; CB 11.1,-21.44; P7 -11.1,-13.87; P8 0,-13.87; P9 11.1,-13.87; T1 -11.1,0; T2 0,0; T3 11.1,0; T4 -11.1,-5.54; T5 0,-5.54; T6 11.1,-5.54 | hole 4.19: -11.1,-32.145; 11.1,10.705
TSMP_R = drill 1.5: T1 -10,10; T2 10,-10 | hole 3.3: 9.15,9.9; -9.15,-9.9

### Placement (x,y rotation side)
24V  162.56,26.67 0 top
24V-5V  96.52,33.02 270 top
24V-8.2V  203.2,71.12 270 top
24V-12V  96.52,73.66 270 top
BMS_CHARGER  120.65,16.51 0 top
BMS_FAULT_RELAY  154.94,25.4 0 top
C1  223.52,27.94 180 top
C2  245.11,97.79 270 bottom
C3  238.76,26.67 0 top
C4  97.79,71.12 180 bottom
C5  242.57,10.16 90 top
C6  149.86,87.63 270 bottom
C7  106.68,83.82 270 bottom
C8  96.52,95.25 180 top
CHARGER_RELAY  184.15,17.78 180 top
EXT1  100.33,102.87 180 top
EXT2  120.65,102.87 180 top
EXT3  140.97,102.87 180 top
EXT4  161.29,102.87 180 top
EXT5  181.61,102.87 180 top
EXT6  201.93,102.87 180 top
F1  222.25,16.51 0 top
F2  134.62,26.67 180 top
F4  222.25,22.86 0 top
F5  194.31,45.72 270 top
IMD_FAULT_RELAY  147.32,25.4 0 top
INT1  222.25,6.35 0 top
INT2  80.01,6.35 0 top
INT3  161.29,6.35 0 top
INT4  100.33,6.35 0 top
INT5  120.65,6.35 0 top
INT6  140.97,6.35 0 top
INT7  201.93,6.35 0 top
INT8  181.61,6.35 0 top
MOS1  217.17,77.47 0 top
MOS2  217.17,88.9 0 top
MOS3  199.39,88.9 0 top
MOS4  199.39,77.47 0 top
MOS5  214.63,58.42 270 bottom
MOS6  217.17,88.9 180 bottom
MOS7  199.39,77.47 180 bottom
MOS8  199.39,88.9 180 bottom
Q1  113.03,26.67 90 top
R1  212.09,48.26 270 bottom
R2  205.74,77.47 90 bottom
R3  170.18,48.26 90 bottom
R4  217.17,48.26 90 bottom
R5  223.52,77.47 270 top
R6  223.52,88.9 270 top
R7  41.91,63.5 90 bottom
R8  130.81,48.26 90 bottom
R9  80.01,109.22 270 top
R10  205.74,77.47 270 top
R11  196.85,57.15 270 top
R12  184.15,26.67 90 top
R13  205.74,88.9 270 top
R14  80.01,82.55 270 bottom
R15  223.52,88.9 270 bottom
R16  241.3,16.51 270 top
R17  236.22,16.51 90 top
R18  241.3,73.66 270 bottom
R19  87.63,109.22 270 top
R20  90.17,95.25 0 top
R21  205.74,88.9 90 bottom
R22  106.68,91.44 90 bottom
R23  233.68,53.34 90 bottom
R24  124.46,59.69 270 bottom
R25  193.04,57.15 270 top
R26  110.49,15.24 180 top
R27  121.92,26.67 90 top
R28  189.23,26.67 90 top
RELAY_FANS  194.31,64.77 90 top
SERVOS  210.82,31.75 270 top
SHUTDOWN_CKT_STATE  80.01,101.6 0 top
SHUTDOWN_STATE  83.82,110.49 270 top
SSR_AIR2  73.66,90.17 270 bottom
SSR_PRECHARGE  73.66,83.82 270 bottom
SV2  219.71,104.14 270 top
TEENSY_3.6  237.49,64.77 270 top
TRANSCEIVER  238.76,22.86 90 top
TS  6.35,39.37 90 top
TSMP  6.35,17.78 90 top
TSV_SENSE  86.36,101.6 0 top
TSV_STATE  83.82,107.95 90 top
U$1  73.66,97.79 0 top
U$3  71.12,101.6 270 bottom
U$4  151.13,15.24 180 top
U$5  134.62,16.51 180 top
U$6  170.18,69.85 0 top
U$7  130.81,69.85 0 top
U$9  41.91,19.05 180 top
U$14  20.32,97.79 180 top

### Tracks (layer width: path | path; a pad name or v marks a point on that pad's centre or on a via)
3.3V  (via drill 0.35)
  Top 0.508: TSV_SENSE.4 85.04,104.62 83.52,103.1 80.54,103.1 79.02,104.62 78.79,104.62 SHUTDOWN_CKT_STATE.4 78.49,104.7 76.28,104.7 74.3,106.68 73.08,106.68 72.24,105.84 72.24,104.7 77.27,99.67 81.99,99.67 v100.97,80.7 | 147.98,29.57 146.91,28.5 146.07,28.5 IMD_FAULT_RELAY.4 | 147.98,29.57 152.55,29.57 153.62,28.5 BMS_FAULT_RELAY.4 153.85,28.57 154.84,29.57 166.5,29.57 170.69,25.38 v174.35,25.38 | v128.32,59.66 128.32,49.38 147.9,29.79 147.98,29.57
  Top 0.61: TRANSCEIVER.3 240.99,23.5 238.9,25.58 238.9,45.99 231.14,53.76 231.14,55.88 TEENSY_3.6.3V3
  Bottom 0.508: R23.2 233.63,54.79 232.26,54.79 229.9,57.15 TEENSY_3.6.3V3 229.67,57 227.23,57 218.31,48.08 201.02,48.08 178.31,25.38 v174.35,25.38 | v100.97,80.7 119.33,62.33 125.65,62.33 v128.32,59.66
5V  (via drill 0.35)
  Top 0.508: v218.77,112.62 238.66,92.73 245.06,92.73 TEENSY_3.6.VIN
  Bottom 0.508: TEENSY_3.6.VIN 246.43,94.03 246.43,97.38 245.13,98.68 245.13,99.14 C2.1 | 24V-5V.P8 96.47,19.05 94.79,20.73 94.79,60.43 96.32,61.95 96.32,71.09 C4.1 96.09,71.17 85.42,71.17 74.91,81.69 74.91,91.36 75.82,92.28 84.43,92.28 97.54,105.39 98.22,105.39 EXT1.4 98.45,105.54 105.46,112.55 112.55,112.55 115.82,109.27 115.82,106.45 118.03,104.24 123.22,104.24 123.9,104.93 123.9,107.67 128.85,112.62 v218.77,112.62
8.2V
  Top 1.524: 24V-8.2V.7 24V-8.2V.8 222.3,34.56 224.92,31.94 C1.1 224.92,24 226.06,22.86 | 226.06,22.86 F4.2 | F1.2 225.84,22.64 226.06,22.86
12V  (via drill 0.35)
  Top 0.508: v196.06,97.61 201.32,102.87 EXT6.1 | v162.84,98.98 162.23,98.98 v161.16,97.92 | INT7.2 206.96,6.4 201.93,6.4 INT7.1 201.7,6.48 198.5,6.48 186.16,18.82 157.2,18.82 153.85,22.17 BMS_FAULT_RELAY.1 153.62,22.33 152.48,21.18 148.06,21.18 146.91,22.33 146.07,22.33 IMD_FAULT_RELAY.1 146,22.1 v142.19,18.29 | C5.1 242.54,8.69 237.21,8.69 234.93,6.4 232.41,6.4 INT1.3 | INT5.3 130.84,6.4 136.55,12.12 136.55,16.46 U$5.1 136.55,16.76 136.55,18.97 132.44,23.09 116.28,23.09 115.9,23.47 115.9,25.3 118.72,28.12 | 118.72,28.12 121.92,28.12 R27.2 | 118.72,28.12 117.88,28.96 Q1.3 117.73,29.18 117.73,34.9 116.28,36.35 116.28,45.03 119.63,48.39 U$7.CA | EXT1.8 101.8,100.28 101.8,64.92 96.55,59.66 24V-12V.P8
  Bottom 0.508: 181.66,100.13 181.66,102.87 EXT5.1 | 181.66,100.13 184.18,97.61 v196.06,97.61 | 135.79,102.34 138.84,105.39 EXT3.4 | 135.79,102.34 135.1,101.65 118.8,101.65 117.5,100.36 101.88,100.36 EXT1.8 | 181.66,100.13 180.52,98.98 v162.84,98.98 | v161.16,97.92 140.21,97.92 135.79,102.34 | INT7.2 207.03,6.4 210.39,6.4 211.61,7.62 231.19,7.62 232.41,6.4 INT1.3 | v142.19,18.29 142.19,17.75 130.84,6.4 INT5.3 | R24.2 124.44,58.22 124.44,53.19 119.71,48.46 U$7.CA 119.48,48.54 108.43,59.59 96.55,59.59 24V-12V.P8
AIR1+
  Bottom 0.508: SSR_PRECHARGE.3 70.64,82.53 70.64,15.77 80.01,6.4 INT2.1
AIR2+  (via drill 0.35)
  Top 0.508: v70.79,86.03 70.79,20.65 INT2.2
  Bottom 0.508: v70.79,86.03 70.64,86.18 70.64,88.85 SSR_AIR2.3
BMS-IMD
  Top 0.508: U$7.P8 130.84,56.01 139.6,56.01 146.23,62.64 168.55,62.64 170.16,64.24 U$6.T5
BMS_CHARGING_PIN
  Top 0.508: CHARGER_RELAY.3 182.88,14.71 169.62,14.71 161.31,6.4 INT3.1
BMS_FAULT
  Top 0.508: INT4.1 100.36,6.4 105.39,6.4 INT4.2 105.46,6.63 105.46,41.76 119.63,55.93 U$7.P7
  Bottom 0.508: R24.1 124.44,61.04 124.44,60.73 119.71,56.01 U$7.P7
BMS_RESET-  (via drill 0.35)
  Top 0.508: INT4.3 110.49,6.33 111.71,5.11 126.26,5.11 132.59,11.43 132.59,16.46 U$5.2 132.66,16.76 v132.66,21.72
  Bottom 0.508: 132.66,48.46 141.88,48.46 U$7.CB | 132.66,48.46 129.69,48.46 129.16,49 129.16,59.97 124.89,64.24 119.71,64.24 U$7.T4 | 132.66,48.46 v132.66,21.72
BOTS+
  Top 0.508: EXT4.2 159.72,100.28 159.72,98.53 145.31,84.12 145.31,78.79 130.84,64.31 U$7.T5
BRAKE_LIGHT-  (via drill 0.35)
  Top 0.508: v162.15,110.87 175.18,110.87 178.31,107.75 178.31,104.93 179.15,104.09 184.78,104.09 186.31,102.56 186.31,102.49 195.83,92.96 208.71,92.96 212.75,88.92 MOS2.4
  Bottom 0.508: v162.15,110.87 146.84,110.87 141.43,105.46 140.97,105.46 EXT3.5
BUZZER-
  Top 0.508: EXT5.8 183.19,100.28 187.53,100.28 195.53,92.28 198.27,92.28 200.25,90.3 200.25,85.65 205.74,80.16 210.08,80.16 212.75,77.5 MOS1.4
CHARGE_SWITCH-
  Top 0.508: CHARGER_RELAY.4 185.4,14.71 184.86,14.71 176.56,6.4 INT3.4
CHARGER+
  Top 0.508: BMS_CHARGER.4 119.41,19.51 119.41,15.16 120.62,13.95 120.62,6.4 INT5.1
CHARGER-
  Top 0.508: BMS_CHARGER.3 121.92,15.16 125.73,11.35 INT5.2
FAN1_PWM
  Bottom 0.254: EXT2.5 128.55,113.31 219.07,113.31 219.46,112.93 219.46,111.78 245.06,86.18 245.06,85.11 TEENSY_3.6.23/A9
FAN2_PWM  (via drill 0.35)
  Top 0.254: v232.56,91.52 240.03,84.05 242.54,84.05 243.99,82.6 245.06,82.6 TEENSY_3.6.22/A8 | v135.1,87.4 122.22,100.28 EXT2.8
  Bottom 0.254: v232.56,91.52 230.35,93.73 163.98,93.73 157.66,87.4 v135.1,87.4
FAN3_PWM
  Bottom 0.254: TEENSY_3.6.21/A7 245.06,80.01 245.06,81.15 243.61,82.6 243.61,86.79 218.31,112.09 164.36,112.09 156.13,103.86 156.13,103.17 154.76,101.8 139.37,101.8 138.3,102.87 EXT3.3
FAN4_PWM  (via drill 0.35)
  Top 0.254: v232.56,92.51 236.6,92.51 243.61,85.5 243.61,85.11 244.68,84.05 245.06,84.05 246.13,82.98 246.13,79.55 245.13,78.56 245.13,77.5 TEENSY_3.6.20/A6 | v148.13,88.09 148.13,94.64 142.49,100.28 EXT3.8
  Bottom 0.254: v232.56,92.51 232.18,92.51 230.5,94.18 163.83,94.18 157.58,87.94 148.28,87.94 v148.13,88.09
FANS_PWR
  Top 0.508: EXT2.1 120.7,102.87 120.7,103.4 122.68,105.39 EXT2.6 122.91,105.23 123.6,105.23 127.18,101.65 139.6,101.65 140.74,102.79 EXT3.1 143.18,105.08 EXT3.6 143.1,105.39 146.84,101.65 160.17,101.65 161.01,100.81 161.01,98.91 160.32,98.22 160.32,93.12 187.38,66.06 191.19,66.06 RELAY_FANS.3
GLV+
  Top 1.27: EXT1.6 102.41,105.39 102.87,105.39 105.16,103.1 105.16,95.1 127.03,73.23 127.03,30.63 130.99,26.67 F2.2
GND  (via drill 0.35)
  Top 0.508: C3.2 240.18,26.67 240.18,26.52
  other vias: 208.28,49.53 214.63,46.99 85.09,109.22 81.56,107.91 209.55,54.61 209.55,59.69 238.76,20.32 235.96,19.74 220.9,82.95 219.71,88.9 203.2,88.9 92.71,92.71 104.14,92.71 214.63,83.82 223.52,92.71 149.86,26.67 186.69,30.48 142.24,86.36 240.03,29.21 121.92,8.89 106.68,80.01 213.36,99.06 226.06,90.17
  pour Top: 67.31,118.11 67.31,-6.35 257.81,-6.35 257.81,118.11
  pour Bottom: 67.31,118.11 67.31,-8.89 257.81,-8.89 257.81,118.11
HVDSIG
  Bottom 0.508: R23.1 233.63,51.89 232.26,51.89 229.9,49.53 TEENSY_3.6.26 229.67,49.38 225.25,49.38 182.27,6.4 181.66,6.4 INT8.1
HVDSIGNALOUT  (via drill 0.35)
  Top 0.508: 192.25,46.33 191.95,46.63 191.95,51.97 193.01,53.03 193.01,55.7 R25.2 | 192.25,46.33 196.37,46.33 196.82,46.79 196.82,55.7 R11.2 | INT6.1 140.97,6.33 144.32,6.33 146.23,4.42 169.54,4.42 171.45,6.33 INT3.3 | v190.73,25.68 192.18,27.13 192.18,46.1 192.25,46.33 | EXT1.7 103.1,102.87 v103.1,96.47 103.02,96.24 102.79,96.01 v102.79,85.27 102.79,63.48 96.55,57.23 96.55,47.09 24V-5V.P1
  Bottom 0.508: v190.73,25.68 171.45,6.4 INT3.3 | EXT5.7 184.4,102.87 184.4,104.47 184.86,104.93 184.86,105.92 179.91,110.87 167.72,110.87 164.59,107.75 164.59,104.93 163.75,104.09 162.69,104.09 161.54,102.95 EXT4.1 161.31,102.87 161.31,100.13 162,99.44 162,93.12 157.96,89.08 149.88,89.08 C6.1 149.66,88.92 132.51,88.92 128.93,85.34 106.91,85.34 C7.1 106.68,85.27 v102.79,85.27 98.91,85.27 96.55,87.63 24V-12V.P1 96.32,87.55 95.02,86.26 76.2,86.26 75.59,85.65 75.59,81.99 76.43,81.15 80.01,81.15 R14.2 | v103.1,96.47 106.68,92.89 R22.2 | INT6.1 140.97,6.33 137.62,6.33 136.4,5.11 130.3,5.11 96.55,38.86 96.55,47.02 24V-5V.P1
IMD_FAULT
  Top 0.508: INT6.2 146.07,6.4 151.1,6.4 INT6.3
  Bottom 0.508: INT6.3 151.18,6.33 152.4,5.11 156.74,5.11 172.67,21.03 172.67,26.67 24V.3 172.59,26.9 172.59,41.15 159.11,54.63 159.11,55.93 U$6.P7
IMD_RESET-
  Top 0.508: U$4.1 153.16,15.24 153.16,9.45 156.21,6.4 INT6.4
  Bottom 0.508: U$6.T4 159.03,64.24 157.43,62.64 157.43,55.32 159.03,53.72 159.03,48.46 U$6.CA 159.03,48.16 155.68,44.81 155.68,36.42 156.21,35.89 INT6.4
MC1_RX  (via drill 0.35)
  Top 0.508: v222.2,98.68 222.2,99.06 220.98,100.28 SV2.8
  Bottom 0.508: v222.2,98.68 221.97,98.45 218.44,98.45 216.51,96.52 208.28,96.52 206.35,98.45 187.07,98.45 183.11,102.41 183.11,103.02 181.66,104.47 181.66,105.39 EXT5.5
MC1_TX
  Top 0.508: EXT5.6 183.72,105.39 184.48,105.39 186.92,102.95 186.92,102.87 188.14,101.65 196.29,101.65 198.73,104.09 202.39,104.09 203.45,103.02 203.45,102.41 205.51,100.36 218.39,100.36 SV2.7
MC2_RX
  Bottom 0.508: SV2.6 219.76,101.65 217.17,101.65 217.17,99.11 215.9,97.84 212.22,97.84 205.97,104.09 203.68,104.09 202.39,105.39 201.93,105.39 EXT6.5
MC2_TX
  Top 0.508: EXT6.6 204.06,105.39 204.67,105.39 208.41,101.65 217.17,101.65 218.39,102.87 SV2.5
N$1
  Bottom 1.524: 24V-8.2V.6 214.7,44.23 R1.2
N$2
  Bottom 0.508: 24V-8.2V.2 214.66,68.58 214.66,62.87 MOS5.4
N$3
  Top 1.524: F2.1 148.03,26.67 149.32,25.38 160.91,25.38 161.36,24.93 163.76,24.93 165.5,26.67 24V.2
N$4
  Top 0.508: RELAY_FANS.2 197.36,66.06 197.36,75.13 195.07,77.42 MOS4.4
N$5
  Bottom 0.813: TSMP.1_2 TSMP.1_1 48.23,12.73 U$9.T1
N$6
  Bottom 0.813: U$14.T1 30.32,87.6 24.29,81.57 24.29,31.27 TSMP.2_2 TSMP.2_1
N$7
  Bottom 1.27: R7.2 39.22,83.35 U$1.P$5
N$8
  Top 0.508: RELAY_FANS.1 197.36,63.48 197.36,59.05 196.9,58.6 R11.1
N$9
  Top 0.508: SHUTDOWN_CKT_STATE.1 78.72,98.53 74.37,98.53 73.69,97.84 U$1.P$1
  Bottom 0.508: U$1.P$1 71.86,99.59 71.17,99.59 U$3.2
N$10  (via drill 0.35)
  Top 0.508: CHARGER_RELAY.2 182.88,23.7 179.3,27.28 v179.3,60.05
  Bottom 0.508: v179.3,60.05 195,75.74 195,77.42 MOS7.4
N$11
  Top 0.152: R28.2 189.21,28.12 189.21,48.08 181.36,55.93 U$6.P9
  Bottom 0.152: R3.2 170.23,49.68 175.03,49.68 181.28,55.93 U$6.P9
N$12
  Top 1.524: F1.1 SERVOS.4
N$13
  Top 1.524: F4.1 212.09,22.86 SERVOS.3
N$14
  Top 0.508: RELAY_FANS.4 191.26,63.48 191.26,62.64 194.39,59.51 194.39,49.45 194.31,49.38 F5.1
N$15
  Bottom 0.508: R14.1 78.94,85.04 76.73,85.04 SSR_PRECHARGE.1 | R14.1
N$16
  Bottom 0.152: R8.2 130.84,49.68 135.64,49.68 141.88,55.93 U$7.P9
N$17  (via drill 0.35)
  Top 0.508: v176.86,83.97 190.12,83.97 195,88.85 MOS3.4
  Bottom 0.508: v176.86,83.97 105.92,83.97 104.55,82.6 76.73,82.6 SSR_PRECHARGE.2
N$18
  Top 0.508: SHUTDOWN_STATE.A 80.09,110.49 80.01,110.57 R9.1
N$19
  Top 0.508: TSV_STATE.A 84.89,107.97 85.04,107.97 87.63,110.57 R19.1
N$20
  Top 0.61: TRANSCEIVER.4 241.51,33.23 TEENSY_3.6.34/A15
N$21  (via drill 0.35)
  Top 0.508: v148.59,23.72 IMD_FAULT_RELAY.2 | v148.59,32.08 179.6,63.09 179.6,68.12 181.28,69.8 U$6.T3
  Bottom 0.508: v148.59,32.08 v148.59,23.72
N$22
  Top 0.508: TSV_SENSE.1 85.11,98.53 85.42,98.53 88.7,95.25 R20.1
N$23  (via drill 0.35)
  Top 0.508: BMS_FAULT_RELAY.2 155.45,22.35 154.07,23.72 v152.35,23.72
  Bottom 0.508: v152.35,23.72 152.35,26.87 149.43,29.79 149.43,62.33 141.96,69.8 U$7.T3
N$24
  Bottom 0.508: SSR_AIR2.1 105.31,91.44 106.68,90.07 R22.1
N$25
  Top 0.61: TRANSCEIVER.1 241.94,20.95 245.11,24.13 TEENSY_3.6.33/A14
N$26
  Top 0.61: C3.1 237.36,26.11 TRANSCEIVER.5 236.22,24.98 237.22,23.98 237.22,19.2 | R17.2 236.22,18.2 237.22,19.2 | 237.22,19.2 238.48,17.93 R16.1
N$27  (via drill 0.35)
  Top 0.508: v161.16,93.42 176.17,93.42 v180.67,88.92
  Bottom 0.508: v161.16,93.42 136.02,93.42 131.37,88.77 105.61,88.77 105.31,89.08 80.7,89.08 80.54,88.92 76.73,88.92 SSR_AIR2.2 | v180.67,88.92 195,88.92 MOS8.4
N$30
  Top 0.152: R26.2 109.12,15.24 109.12,24.46 111.33,26.67 Q1.2
N$31
  Top 0.152: CHARGER_RELAY.1 185.4,20.88 185.4,21.87 179.83,27.43 179.83,56.62 181.74,58.52 193.01,58.52 R25.1
N$32
  Top 0.152: BMS_CHARGER.1 119.33,13.49 113.69,13.49 111.94,15.24 R26.1
PRECHRG_RLY-
  Bottom 0.508: INT5.4 135.94,6.4 136.7,6.4 137.92,7.62 148.06,7.62 151.26,4.42 157.05,4.42 173.51,20.88 173.51,25.68 200.25,52.43 200.25,80.77 205.74,86.26 210.16,86.26 212.75,88.85 MOS6.4
SIG_8.2V_ON/OFF
  Bottom 1.524: R4.2 216.91,49.94 MOS5.1 224.41,63.12 224.41,81.96 227.33,84.89 227.33,87.63 TEENSY_3.6.0/RX
SIG_AIR2
  Bottom 0.254: MOS8.1 202.24,91.14 203,90.37 205.74,90.37 R21.2 205.82,90.45 207.65,92.28 221.59,92.28 222.2,91.67 230.5,91.67 232.56,89.61 232.56,83.74 229.9,81.08 229.9,80.01 TEENSY_3.6.4/CANRX
SIG_BMS_FAULT  (via drill 0.35)
  Top 0.254: v164.29,28.42 156.21,28.42 BMS_FAULT_RELAY.3 | v171.6,21.11 180.44,21.11 182.19,19.36 v196.37,19.36
  Bottom 0.254: v171.6,21.11 v164.29,28.42 | v196.37,19.36 216.48,39.47 218.92,39.47 220.6,41.15 220.6,41.38 227.69,48.46 232.41,48.46 241.25,57.3 241.25,72.24 R18.2 241.4,72.31 241.48,72.39 TEENSY_3.6.18/A4/SDA
SIG_BRAKE_LIGHT
  Top 0.254: R6.2 223.5,87.48 220.83,87.48 219.99,86.64 MOS2.1 219.99,86.49 217.7,84.2 217.7,74.68 219.99,72.39 TEENSY_3.6.7
SIG_BUZZER
  Top 0.254: MOS1.1 219.99,75.21 220.83,76.05 223.5,76.05 R5.2 223.57,75.97 224.56,74.98 229.82,74.98 TEENSY_3.6.6
SIG_CAN_H  (via drill 0.35)
  Top 0.508: INT7.3 212.14,6.33 215.42,6.33 216.64,5.11 220.83,5.11 221.97,6.25 INT1.1 | R16.2 241.4,15.39 241.4,15.7 246.28,20.57 246.28,70.33 245.36,71.25 244.6,71.25 231.04,84.81 231.04,95.33 220.98,105.39 SV2.4 | EXT5.3 179.91,102.87 181.13,101.65 v186,101.65
  Top 0.61: TRANSCEIVER.7 235.58,22.23 234.8,21.44 234.8,17 235.13,16.68 238.44,16.68 240.03,15.09 R16.2 241.3,13.82 235.11,7.63 230.43,7.63 227.86,5.07 226.8,5.07 225.52,6.35 INT1.1
  Bottom 0.508: EXT4.7 166.57,102.87 167.79,101.65 177.62,101.65 178.84,102.87 EXT5.3 | SV2.4 220.98,105.39 222.2,104.17 222.2,99.82 221.51,99.14 218.19,99.14 216.24,97.18 211.89,97.18 207.57,101.5 201.62,101.5 200.25,102.87 EXT6.3 198.96,102.79 197.81,101.65 v186,101.65
SIG_CAN_L  (via drill 0.35)
  Top 0.508: INT7.4 217.17,6.4 220.07,6.4 221.28,7.62 225.93,7.62 227.08,6.48 INT1.2 | SV2.3 212.98,110.87 205.74,110.87 200.33,105.46 199.87,105.46 EXT6.4 199.8,105.69 199.8,106.6 195.53,110.87 185.4,110.87 179.98,105.46 179.6,105.46 EXT5.4 | v225.32,56.24 225.32,54.94 229.36,50.9 230.12,50.9 231.04,49.99 231.04,28.04 235.38,23.7 TRANSCEIVER.6
  Top 0.61: TRANSCEIVER.6 235.58,23.5 234.04,21.95 234.04,16.68 235.64,15.09 R17.1 227.48,6.35 INT1.2
  Bottom 0.508: EXT4.8 162.84,100.36 178.08,100.36 180.06,102.34 180.06,104.93 179.6,105.39 EXT5.4 | v225.32,56.24 225.32,61.87 229.59,66.14 230.35,66.14 233.4,69.19 233.4,93.57 222.88,104.09 222.88,105.23 221.51,106.6 219.61,106.6 218.47,105.46 SV2.3
SIG_CHARGER_ON/OFF  (via drill 0.35)
  Top 0.254: v218.39,77.5 229.82,77.5 TEENSY_3.6.5
  Bottom 0.254: MOS7.1 202.24,79.7 203,78.94 205.74,78.94 R2.2 205.82,78.79 207.11,77.5 v218.39,77.5
SIG_CHARGING
  Top 0.508: Q1.1 117.88,24.38 118.72,25.22 121.92,25.22 R27.1 122.15,25.15 123.06,24.23 135.03,24.23 154.15,5.11 162.31,5.11 163.53,6.33 166.34,6.33 INT3.2
SIG_FANS_ON/OFF  (via drill 0.35)
  Top 0.254: R10.2 203.07,76.05 202.24,75.21 MOS4.1 | R10.2 | v219.76,62.79 227.91,54.63 229.82,54.63 TEENSY_3.6.24 | v218.08,64.47 217.17,64.47 205.66,75.97 R10.2
  Bottom 0.254: v218.08,64.47 v219.76,62.79
SIG_IMD_FAULT  (via drill 0.35)
  Top 0.254: v151.94,28.42 148.59,28.42 IMD_FAULT_RELAY.3 | v155.37,23.72 171.58,23.72 173.74,21.57 180.59,21.57 182.35,19.81 185.93,19.81 186.16,20.04 186.16,24.16 | 186.16,24.16 186.16,26.06 184.18,28.04 R12.2 | v211.76,27.81 193.93,27.81 190.27,24.16 186.16,24.16
  Bottom 0.254: v155.37,23.72 154.48,24.61 154.48,25.88 v151.94,28.42 | v211.76,27.81 229.44,45.49 230.05,45.49 241.71,57.15 241.71,57.76 244.68,60.73 245.06,60.73 246.13,61.8 246.13,72.85 245.13,73.84 245.13,74.91 TEENSY_3.6.19/A5/SCL
SIG_PRECHARGE
  Bottom 0.254: MOS6.1 219.91,91.14 223.5,87.55 R15.2 224.71,87.5 228.42,91.21 230.35,91.21 230.96,90.6 230.96,87.25 230.28,86.56 229.9,86.56 228.83,85.5 228.83,69.42 229.82,68.43 229.82,67.36 TEENSY_3.6.9/CS
SIG_PRECHARGE_AIR
  Top 0.254: MOS3.1 202.24,86.64 203.07,87.48 205.74,87.48 R13.2 205.82,87.4 207.57,85.65 211,85.65 216.18,80.47 216.18,75.59 219.84,71.93 220.68,71.93 227.84,64.77 TEENSY_3.6.10/CS
SIG_PUMP_ANALOG  (via drill 0.35)
  Top 0.508: v186.69,72.31 193.78,65.23 197.36,65.23 198.96,63.63 230.12,63.63 241.63,52.12 245.06,52.12 TEENSY_3.6.21/DAC0 | v156.59,94.26 v178.54,72.31
  Bottom 0.508: v178.54,72.31 v186.69,72.31 | v156.59,94.26 106.45,94.26 101.58,99.14 101.35,99.14 100.05,100.43 100.05,100.81 97.99,102.87 EXT1.3
SIG_SERVO1_PWM  (via drill 0.35)
  Top 0.254: v107.75,111.71 212.9,111.71 217.7,106.91 218.47,106.91 219.53,105.84 219.53,100.28 224.87,94.94 224.87,88.62 229.44,84.05 229.82,84.05 230.89,82.98 230.89,71.93 229.9,70.94 229.9,69.88 TEENSY_3.6.8
  Bottom 0.254: v107.75,111.71 103.56,107.52 103.56,104.93 101.5,102.87 EXT1.1
SIG_SERVO2_PWM  (via drill 0.35)
  Top 0.254: v197.66,50.98 214.35,50.98 225.93,39.4 229.82,39.4 TEENSY_3.6.30 | v103.63,94.79 v121.16,77.27
  Bottom 0.254: v197.66,50.98 188.44,50.98 181.89,57.53 173.89,57.53 170.84,54.48 169.54,54.48 160.63,63.4 160.63,64.92 148.28,77.27 v121.16,77.27 | v103.63,94.79 103.63,94.94 98.83,99.75 98.83,100.28 EXT1.2
SIG_SHUTDOWN_STATE  (via drill 0.35)
  Top 0.254: 81.23,106.53 81.23,104.7 SHUTDOWN_CKT_STATE.3 | 81.23,106.53 80.01,107.75 R9.2 | v223.72,104.39 223.5,104.39 220.98,106.91 220.52,106.91 219.53,107.9 219.53,108.36 215.49,112.39 93.42,112.39 88.92,107.9 88.92,106.91 88.62,106.6 81.31,106.6 81.23,106.53
  Bottom 0.254: v223.72,104.39 235,93.12 235,53.8 234.85,53.65 233.17,53.65 231.65,52.12 229.9,52.12 TEENSY_3.6.25
SIG_TSV_STATE  (via drill 0.35)
  Top 0.254: TSV_SENSE.3 87.63,104.7 86.56,104.7 85.57,105.69 83.82,105.69 81.76,103.63 80.77,103.63 79.48,104.93 79.48,106.15 78.72,106.91 78.72,108.74 78.94,108.97 83.36,108.97 83.97,108.36 83.97,107.21 84.12,107.06 86.94,107.06 87.63,107.75 R19.2 87.71,107.9 92.66,112.85 217.55,112.85 231.88,98.53 v231.88,85.65
  Bottom 0.254: v231.88,85.65 229.9,83.67 229.9,82.6 TEENSY_3.6.3/CANTX
SSOK-CSB  (via drill 0.35)
  Top 0.508: EXT4.3 158.72,102.87 161.24,105.39 EXT4.5 162.46,104.24 164.29,104.24 166.88,101.65 168.94,101.65 177.55,93.04 v177.7,93.04
  Bottom 0.508: EXT6.7 203.61,102.87 202.24,104.24 199.34,104.24 197.13,106.45 197.13,109.27 194.84,111.56 167.41,111.56 161.31,105.46 EXT4.5 | v177.7,93.04 177.7,69.49 170.23,62.03 170.23,56.01 U$6.P8
TS_24V  (via drill 0.35)
  Top 0.508: C8.1 97.46,95.25 96.47,96.24 | 96.47,96.24 96.09,96.62 92.96,96.62 R20.2 | R20.2 | v101.5,101.65 100.05,100.2 100.05,99.82 96.47,96.24 | v191.87,40.69 192.94,40.69 194.31,42.06 F5.2 | EXT2.3 117.96,102.87 117.96,83.97 129.16,72.77 129.16,50.37 149.28,30.25 174.19,30.25 177.78,26.67 24V.4
  Bottom 0.508: EXT2.3 115.37,102.87 114.15,101.65 v101.5,101.65 | 24V.4 177.85,26.67 v191.87,40.69 192.1,40.77 208.94,57.61 216.03,57.61 222.28,63.86 222.28,68.58 24V-8.2V.1
TSMS-
  Top 0.508: EXT4.6 163.3,105.46 162.92,105.46 157.5,110.87 102.03,110.87 95.33,104.17 95.33,103.17 93.8,101.65 77.27,101.65 73.69,105.23 U$1.P$2
  Bottom 0.508: SSR_PRECHARGE.4 70.64,85.11 71.02,85.11 71.78,85.88 71.78,90.3 70.64,91.44 SSR_AIR2.4 70.71,91.67 70.71,92.89 75.06,97.23 75.06,100.43 72.08,103.4 72.01,103.63 | 72.01,103.63 71.17,103.63 U$3.1 | 72.01,103.63 73.61,105.23 U$1.P$2
TSV+
  Top 0.813: TS.1_2 TS.1_1
  Top 1.27: TS.1_1 21.12,29.05 U$9.T2
  Bottom 1.27: U$9.T2 38.01,29.05 R7.1
TSV-
  Bottom 0.813: 56.66,105.29 U$1.P$3 | U$14.T2 16.03,102.08 | 15.4,44.87 TS.2_2 TS.2_1
  Bottom 1.27: 16.03,102.08 53.45,102.08 56.66,105.29 | U$14.T2 15.4,102.71 15.4,44.87

### Text on the board
tPlace: IIT HAWKROD S21
tValues: BY: CHARLES STEENSTRA | MAIN BOARD REV 0